# Altium project Fall22 Universal PCB Rev.1.PrjPcb (part 1 of 2)
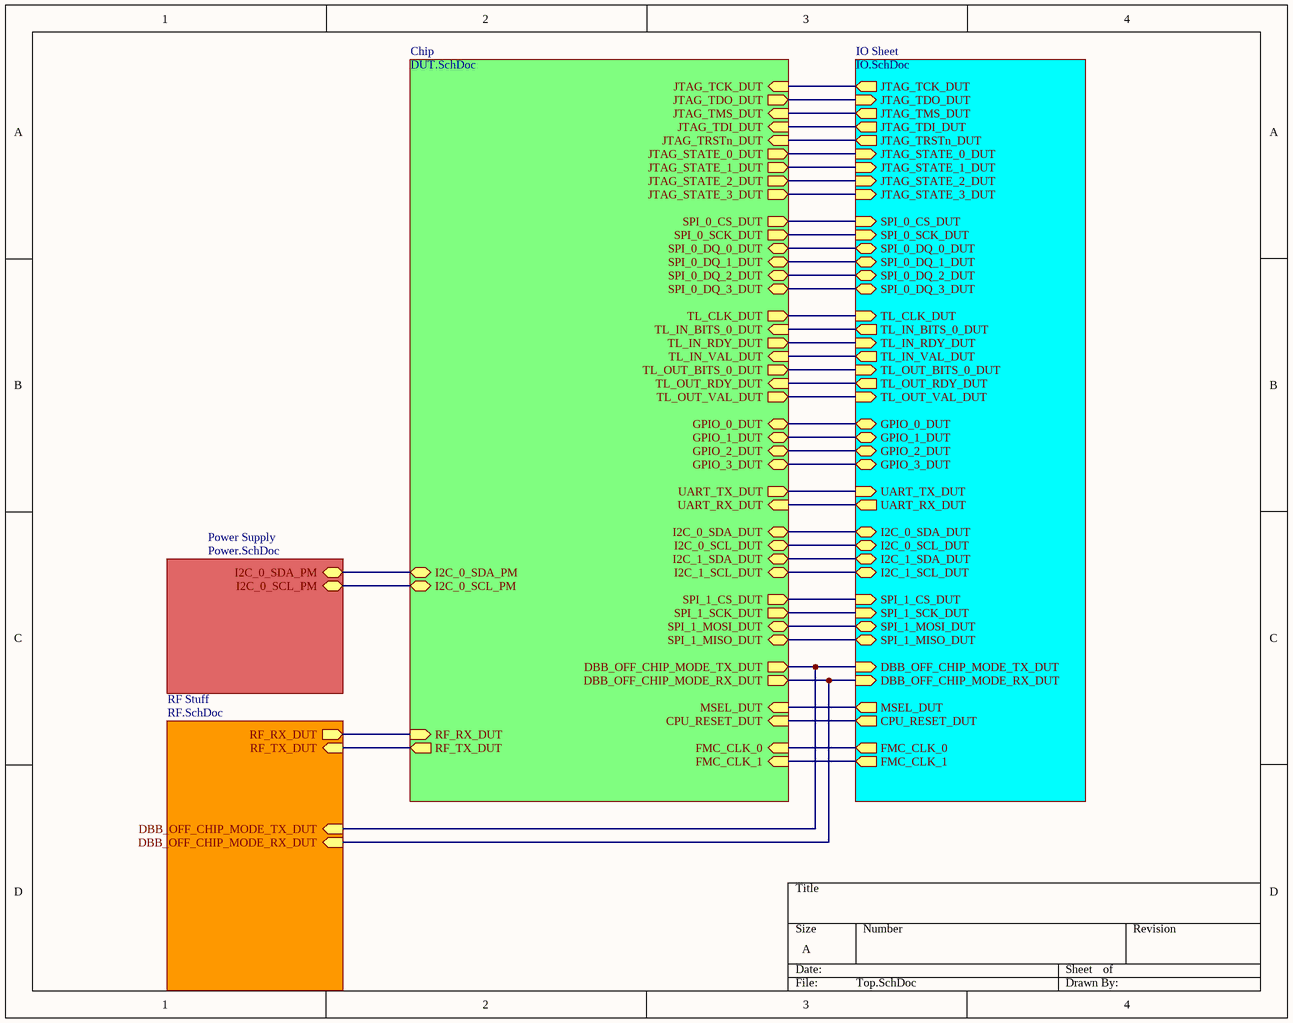
[diagram p0: Top.SchDoc]
5 sheets, 263 parts. Net scope: hierarchical (ports join the sheet entries above them; power ports are global).
Board file: PCB2.PcbDoc
Sheets:
  Top.SchDoc
    Chip = DUT.SchDoc
    Power Supply = Power.SchDoc
    IO Sheet = IO.SchDoc
    RF Stuff = RF.SchDoc

## Sheet Top.SchDoc
size A

### Sub-sheets
Chip = DUT.SchDoc: JTAG_TCK_DUT (in), JTAG_TDO_DUT (out), JTAG_TMS_DUT (in), JTAG_TDI_DUT (in), JTAG_TRSTn_DUT (in), JTAG_STATE_0_DUT (out), JTAG_STATE_1_DUT (out), JTAG_STATE_2_DUT (out), JTAG_STATE_3_DUT (out), TL_CLK_DUT (out), SPI_0_CS_DUT (out), SPI_0_SCK_DUT (out), SPI_0_DQ_0_DUT (bidir), SPI_0_DQ_1_DUT (bidir), SPI_0_DQ_2_DUT (bidir), SPI_0_DQ_3_DUT (bidir), TL_IN_BITS_0_DUT (in), TL_IN_RDY_DUT (out), TL_IN_VAL_DUT (in), TL_OUT_BITS_0_DUT (out), TL_OUT_RDY_DUT (in), TL_OUT_VAL_DUT (out), GPIO_1_DUT (bidir), GPIO_0_DUT (bidir), GPIO_2_DUT (bidir), GPIO_3_DUT (bidir), UART_TX_DUT (out), UART_RX_DUT (in), I2C_0_SDA_DUT (bidir), I2C_0_SCL_DUT (bidir), I2C_1_SDA_DUT (bidir), I2C_1_SCL_DUT (bidir), SPI_1_CS_DUT (out), SPI_1_SCK_DUT (out), SPI_1_MOSI_DUT (bidir), SPI_1_MISO_DUT (bidir), DBB_OFF_CHIP_MODE_RX_DUT (out), DBB_OFF_CHIP_MODE_TX_DUT (out), RF_RX_DUT (in), RF_TX_DUT (out), I2C_0_SDA_PM (bidir), I2C_0_SCL_PM (bidir), MSEL_DUT (in), CPU_RESET_DUT (in), FMC_CLK_0 (in), FMC_CLK_1 (in)
IO Sheet = IO.SchDoc: JTAG_TCK_DUT (out), JTAG_TDO_DUT (in), JTAG_TMS_DUT (out), JTAG_TDI_DUT (out), JTAG_TRSTn_DUT (out), JTAG_STATE_0_DUT (in), JTAG_STATE_1_DUT (in), JTAG_STATE_2_DUT (in), JTAG_STATE_3_DUT (in), SPI_0_CS_DUT (in), SPI_0_SCK_DUT (in), SPI_0_DQ_0_DUT (bidir), SPI_0_DQ_1_DUT (bidir), SPI_0_DQ_2_DUT (bidir), SPI_0_DQ_3_DUT (bidir), TL_CLK_DUT (in), TL_IN_BITS_0_DUT (out), TL_IN_RDY_DUT (in), TL_IN_VAL_DUT (out), TL_OUT_BITS_0_DUT (in), TL_OUT_RDY_DUT (out), TL_OUT_VAL_DUT (in), GPIO_1_DUT (bidir), GPIO_0_DUT (bidir), GPIO_2_DUT (bidir), GPIO_3_DUT (bidir), UART_TX_DUT (in), UART_RX_DUT (out), I2C_0_SDA_DUT (bidir), I2C_0_SCL_DUT (bidir), I2C_1_SDA_DUT (bidir), I2C_1_SCL_DUT (bidir), SPI_1_CS_DUT (in), SPI_1_SCK_DUT (in), SPI_1_MOSI_DUT (bidir), SPI_1_MISO_DUT (bidir), DBB_OFF_CHIP_MODE_RX_DUT (in), DBB_OFF_CHIP_MODE_TX_DUT (in), MSEL_DUT (out), CPU_RESET_DUT (out), FMC_CLK_0 (out), FMC_CLK_1 (out)
Power Supply = Power.SchDoc: I2C_0_SDA_PM (bidir), I2C_0_SCL_PM (bidir)
RF Stuff = RF.SchDoc: RF_RX_DUT (out), RF_TX_DUT (in), DBB_OFF_CHIP_MODE_TX_DUT (in), DBB_OFF_CHIP_MODE_RX_DUT (in)

### Nets
baseband_offChipMode_rx: sheet Chip/DBB_OFF_CHIP_MODE_RX_DUT, sheet IO Sheet/DBB_OFF_CHIP_MODE_RX_DUT, sheet RF Stuff/DBB_OFF_CHIP_MODE_RX_DUT
baseband_offChipMode_tx: sheet Chip/DBB_OFF_CHIP_MODE_TX_DUT, sheet IO Sheet/DBB_OFF_CHIP_MODE_TX_DUT, sheet RF Stuff/DBB_OFF_CHIP_MODE_TX_DUT
BOOT_SEL: sheet Chip/MSEL_DUT, sheet IO Sheet/MSEL_DUT
CPU_RESET_DUT: sheet Chip/CPU_RESET_DUT, sheet IO Sheet/CPU_RESET_DUT
GPIO_0_DUT: sheet Chip/GPIO_0_DUT, sheet IO Sheet/GPIO_0_DUT
GPIO_1_DUT: sheet Chip/GPIO_1_DUT, sheet IO Sheet/GPIO_1_DUT
GPIO_2_DUT: sheet Chip/GPIO_2_DUT, sheet IO Sheet/GPIO_2_DUT
GPIO_3_DUT: sheet Chip/GPIO_3_DUT, sheet IO Sheet/GPIO_3_DUT
I2C2_SCL: sheet Chip/I2C_0_SCL_PM, sheet Power Supply/I2C_0_SCL_PM
I2C2_SDA: sheet Chip/I2C_0_SDA_PM, sheet Power Supply/I2C_0_SDA_PM
I2C_0_SCL_DUT: sheet Chip/I2C_1_SCL_DUT, sheet IO Sheet/I2C_1_SCL_DUT
I2C_0_SDA_DUT: sheet Chip/I2C_1_SDA_DUT, sheet IO Sheet/I2C_1_SDA_DUT
I2C_1_SCL_DUT: sheet Chip/I2C_0_SCL_DUT, sheet IO Sheet/I2C_0_SCL_DUT
I2C_1_SDA_DUT: sheet Chip/I2C_0_SDA_DUT, sheet IO Sheet/I2C_0_SDA_DUT
JTAG_STATE_0_DUT: sheet Chip/JTAG_STATE_0_DUT, sheet IO Sheet/JTAG_STATE_0_DUT
JTAG_STATE_1_DUT: sheet Chip/JTAG_STATE_1_DUT, sheet IO Sheet/JTAG_STATE_1_DUT
JTAG_STATE_2_DUT: sheet Chip/JTAG_STATE_2_DUT, sheet IO Sheet/JTAG_STATE_2_DUT
JTAG_STATE_3_DUT: sheet Chip/JTAG_STATE_3_DUT, sheet IO Sheet/JTAG_STATE_3_DUT
JTAG_TCK: sheet Chip/JTAG_TCK_DUT, sheet IO Sheet/JTAG_TCK_DUT
JTAG_TDI: sheet Chip/JTAG_TDI_DUT, sheet IO Sheet/JTAG_TDI_DUT
JTAG_TDO: sheet Chip/JTAG_TDO_DUT, sheet IO Sheet/JTAG_TDO_DUT
JTAG_TMS: sheet Chip/JTAG_TMS_DUT, sheet IO Sheet/JTAG_TMS_DUT
JTAG_TRST: sheet Chip/JTAG_TRSTn_DUT, sheet IO Sheet/JTAG_TRSTn_DUT
RF_RX_DUT: sheet Chip/RF_RX_DUT, sheet RF Stuff/RF_RX_DUT
RF_TX_DUT: sheet Chip/RF_TX_DUT, sheet RF Stuff/RF_TX_DUT
SCAN_CLK: sheet Chip/SPI_1_SCK_DUT, sheet IO Sheet/SPI_1_SCK_DUT
SCAN_IN: sheet Chip/SPI_1_MISO_DUT, sheet IO Sheet/SPI_1_MISO_DUT
SCAN_OUT: sheet Chip/SPI_1_MOSI_DUT, sheet IO Sheet/SPI_1_MOSI_DUT
SCAN_SEL: sheet Chip/SPI_1_CS_DUT, sheet IO Sheet/SPI_1_CS_DUT
SPI0_CS: sheet Chip/SPI_0_CS_DUT, sheet IO Sheet/SPI_0_CS_DUT
SPI0_DQ0: sheet Chip/SPI_0_DQ_0_DUT, sheet IO Sheet/SPI_0_DQ_0_DUT
SPI0_DQ1: sheet Chip/SPI_0_DQ_1_DUT, sheet IO Sheet/SPI_0_DQ_1_DUT
SPI0_DQ2: sheet Chip/SPI_0_DQ_2_DUT, sheet IO Sheet/SPI_0_DQ_2_DUT
SPI0_DQ3: sheet Chip/SPI_0_DQ_3_DUT, sheet IO Sheet/SPI_0_DQ_3_DUT
SPI0_SCLK: sheet Chip/SPI_0_SCK_DUT, sheet IO Sheet/SPI_0_SCK_DUT
TL_CLK: sheet Chip/TL_CLK_DUT, sheet IO Sheet/TL_CLK_DUT
TL_IN_BITS_0_DUT: sheet Chip/TL_IN_BITS_0_DUT, sheet IO Sheet/TL_IN_BITS_0_DUT
TL_IN_RDY: sheet Chip/TL_IN_RDY_DUT, sheet IO Sheet/TL_IN_RDY_DUT
TL_IN_VAL: sheet Chip/TL_IN_VAL_DUT, sheet IO Sheet/TL_IN_VAL_DUT
TL_OUT_BITS_0_DUT: sheet Chip/TL_OUT_BITS_0_DUT, sheet IO Sheet/TL_OUT_BITS_0_DUT
TL_OUT_RDY: sheet Chip/TL_OUT_RDY_DUT, sheet IO Sheet/TL_OUT_RDY_DUT
TL_OUT_VAL: sheet Chip/TL_OUT_VAL_DUT, sheet IO Sheet/TL_OUT_VAL_DUT
UART0_RX: sheet Chip/UART_RX_DUT, sheet IO Sheet/UART_RX_DUT
UART0_TX: sheet Chip/UART_TX_DUT, sheet IO Sheet/UART_TX_DUT
NetH1_1: sheet Chip/FMC_CLK_0, sheet IO Sheet/FMC_CLK_0
NetH2_1: sheet Chip/FMC_CLK_1, sheet IO Sheet/FMC_CLK_1

## Sheet DUT.SchDoc
size A1; SPICEModelCacheEPBFKGZM: <root> / <DocumentId>EPBFKGZM</DocumentId> / </root>
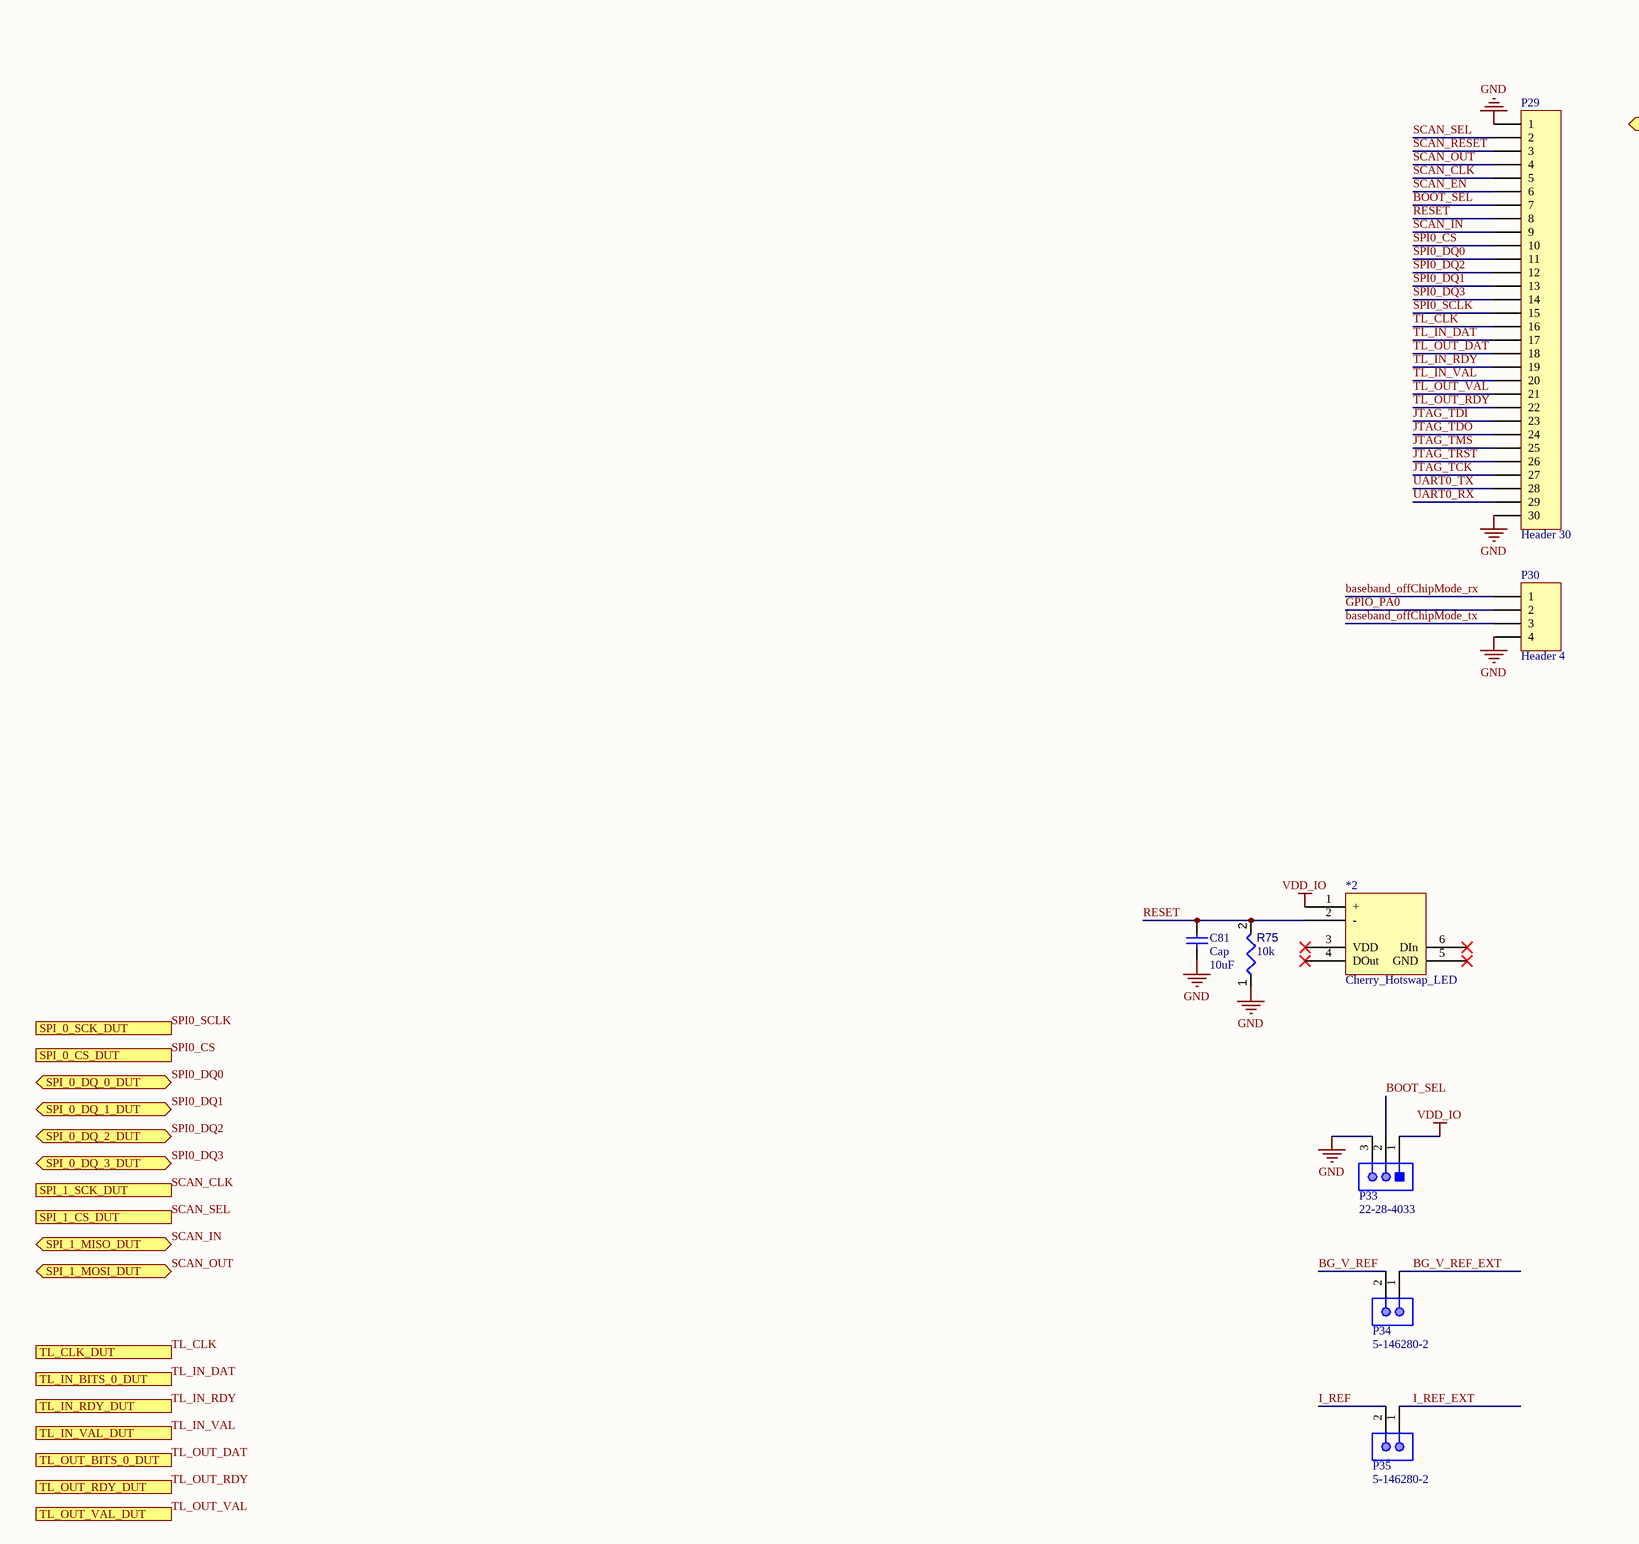
[diagram p1: DUT.SchDoc, top left]
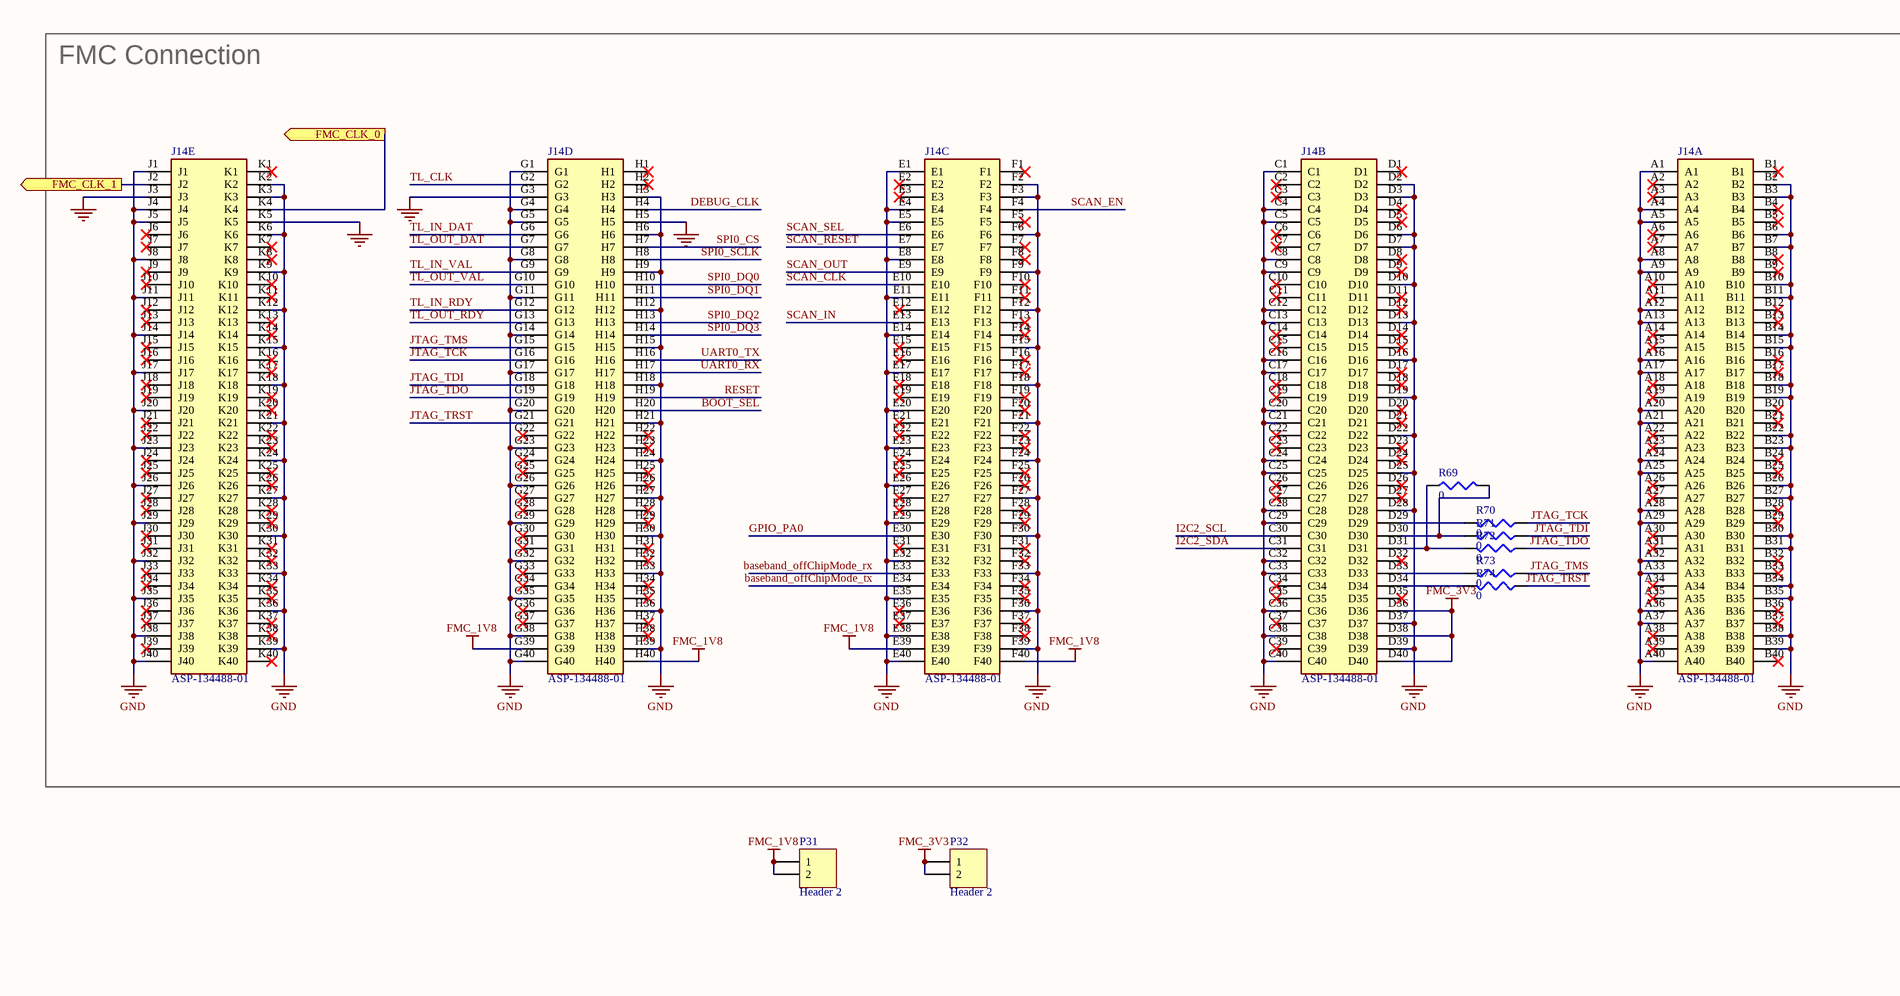
[diagram p2: DUT.SchDoc, top right]
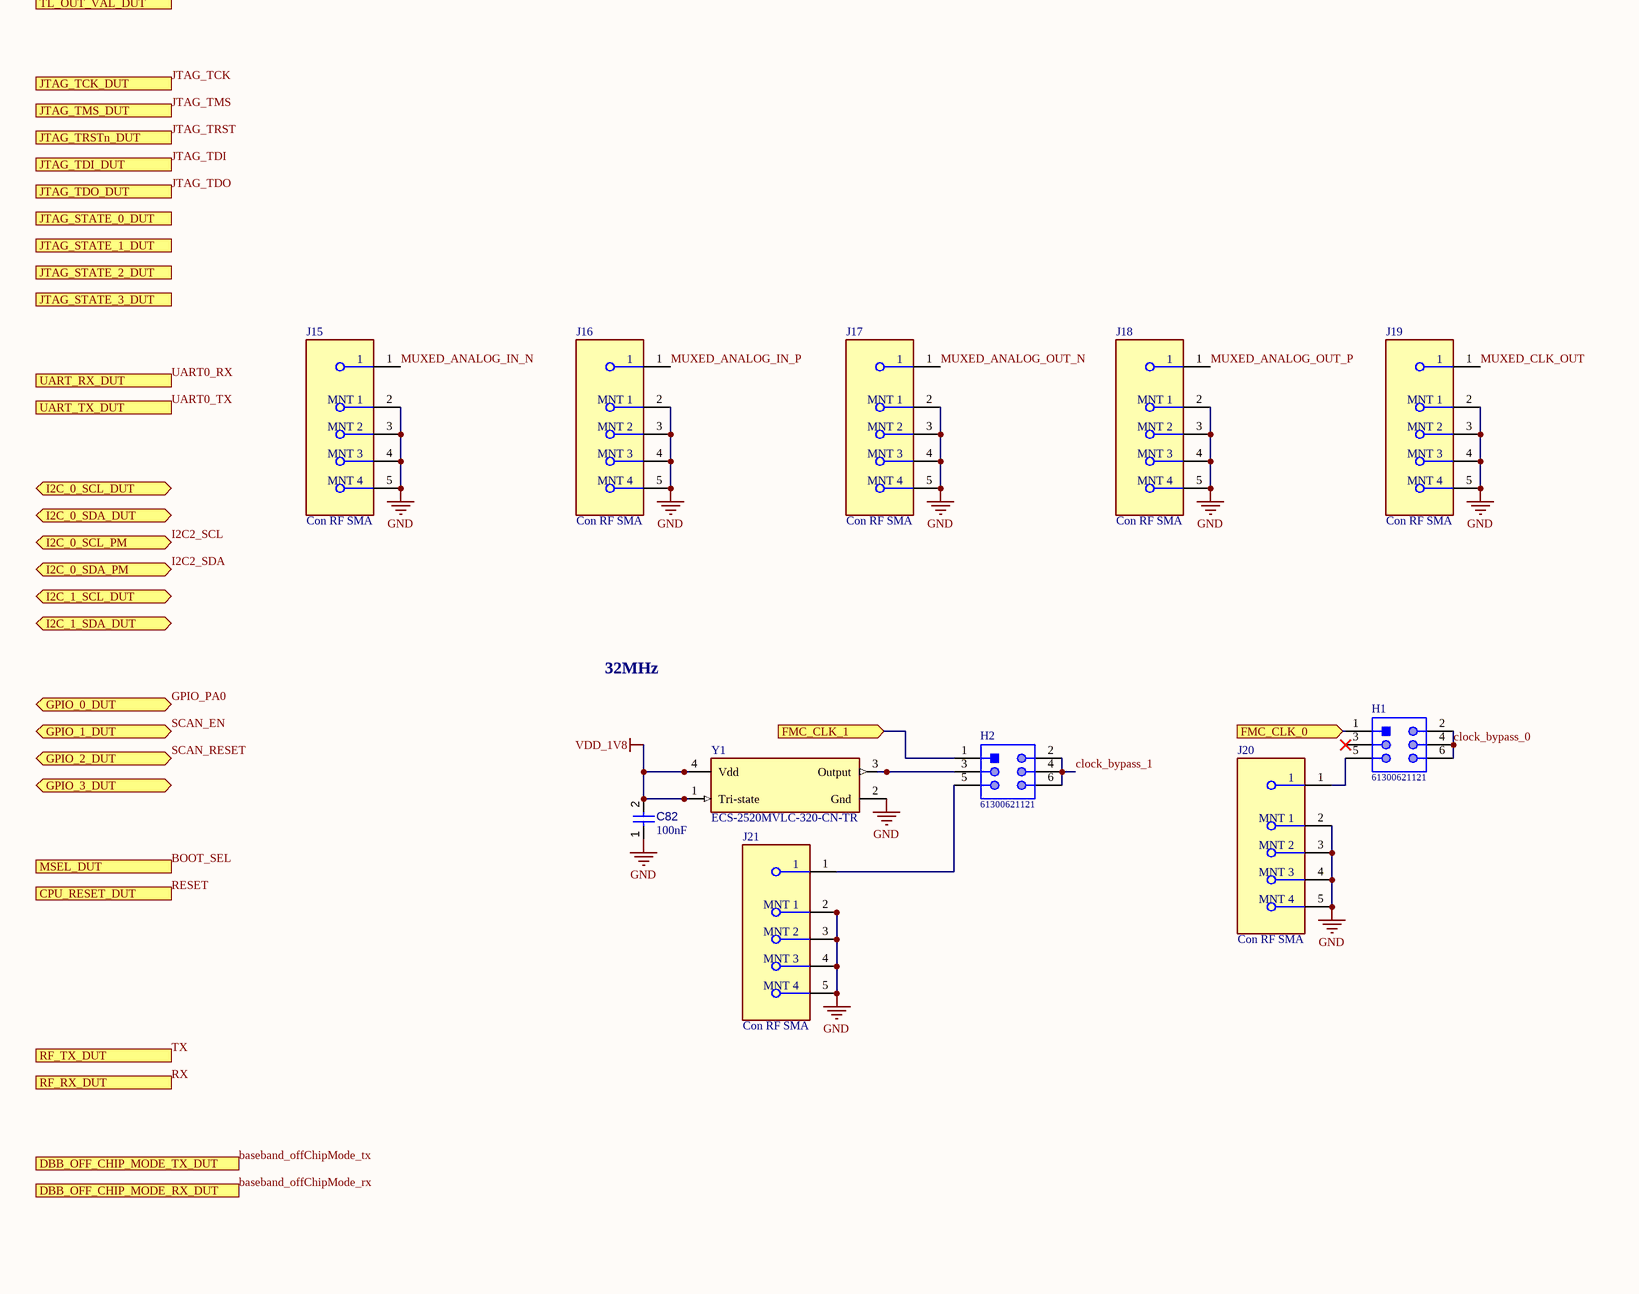
[diagram p3: DUT.SchDoc, bottom left]
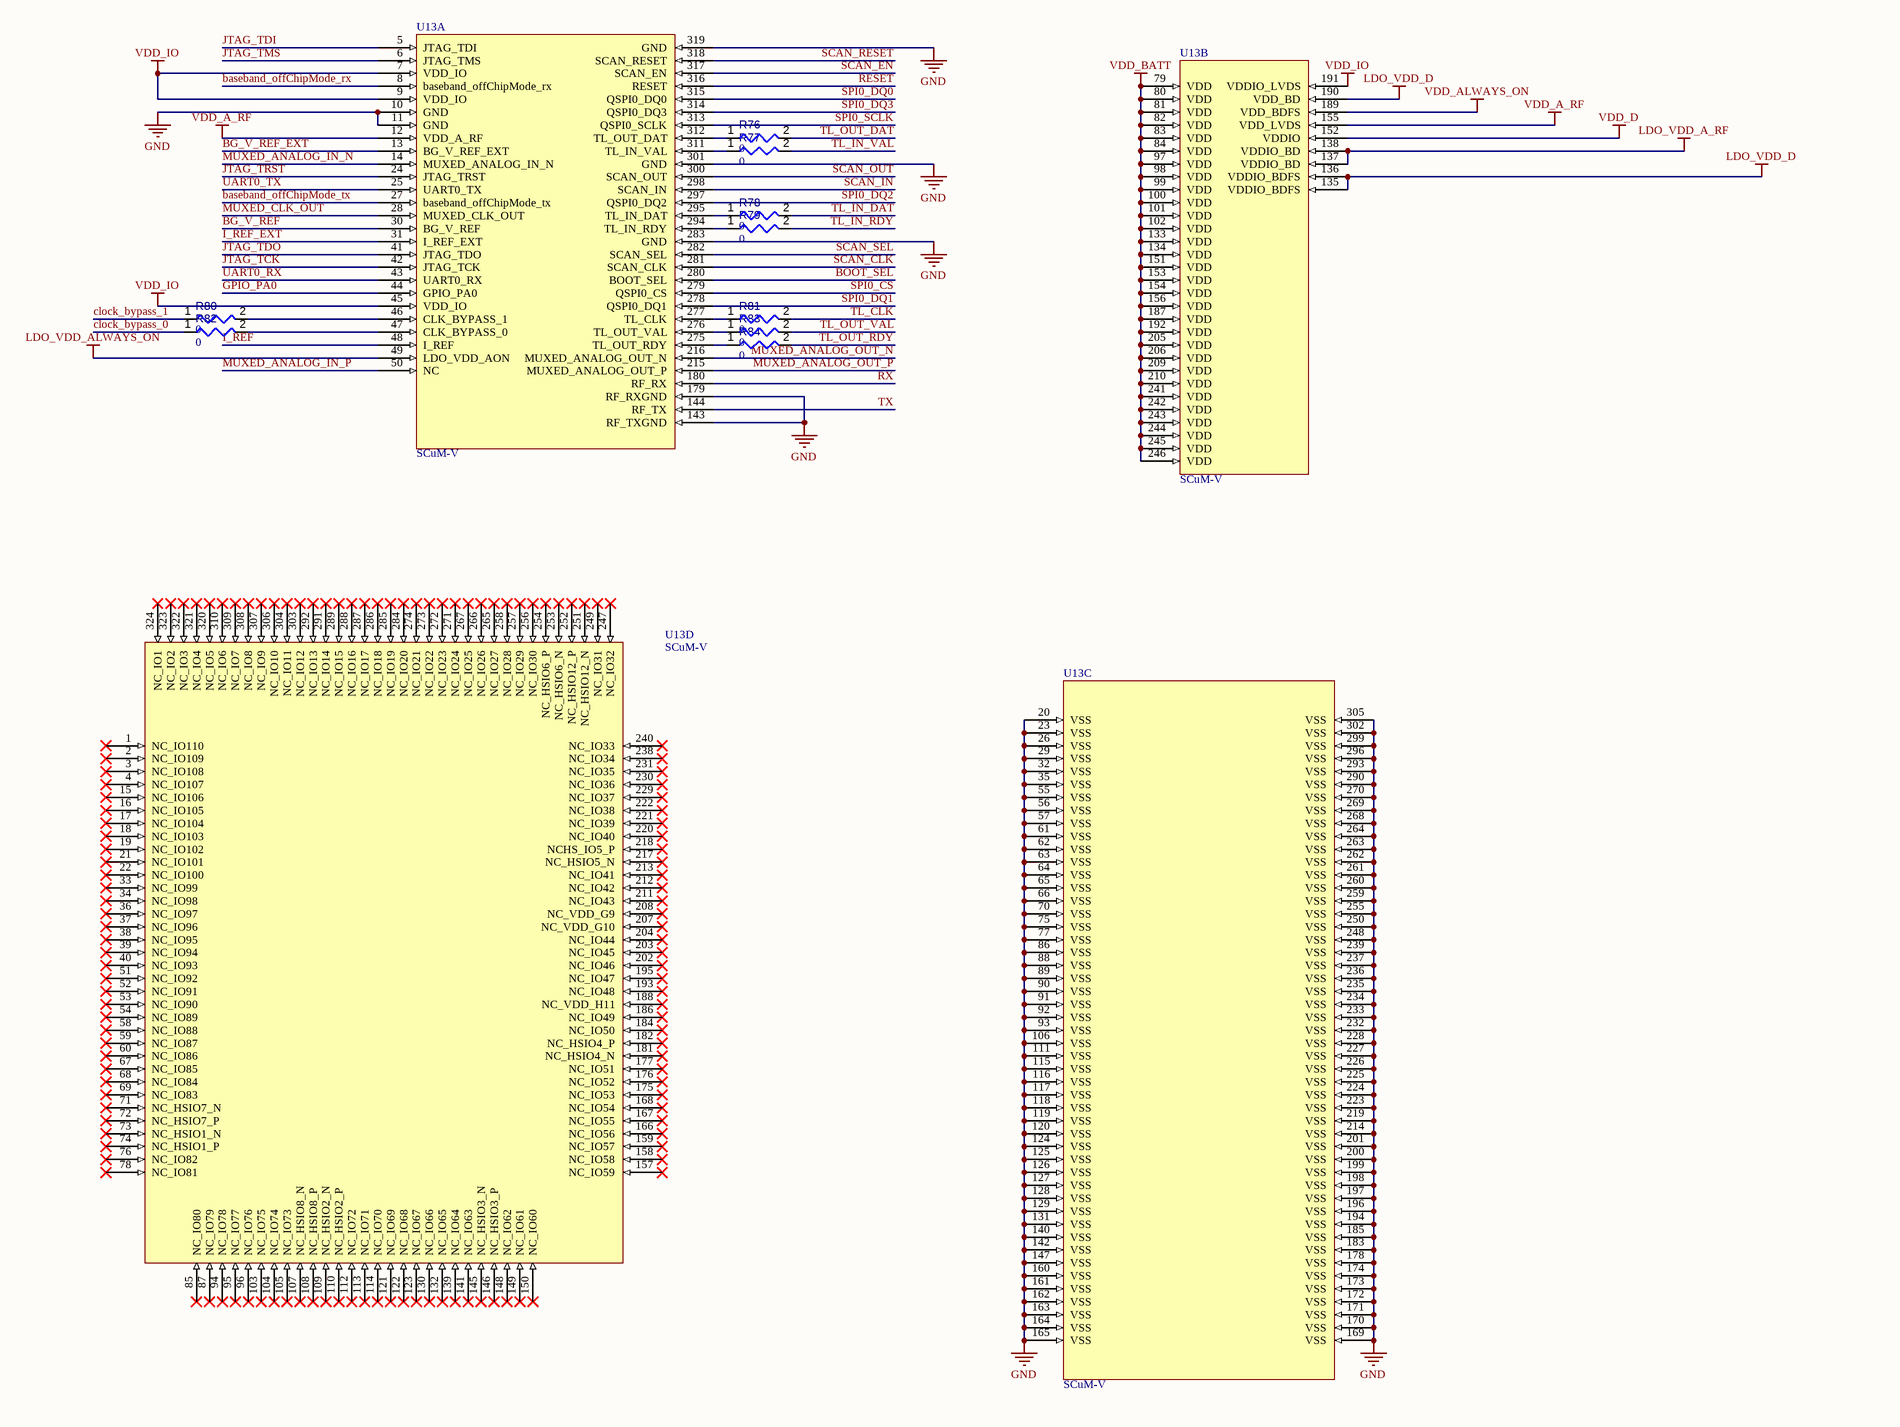
[diagram p4: DUT.SchDoc, bottom right]

### Parts
*2  Cherry_Hotswap_LED  [New footprint 1]
C81  Cap  value 10uF  [0805]
C82  value 100nF  [CAPC1608X90X40NL10T20]  (hidden comment: Capacitor 100 nF +/-10% 50 V 0603)
H1  61300621121  [61300621121]
H2  61300621121  [61300621121]
J14  ASP-134488-01  [SAMTEC_ASP-134488-01]  (parts A,B,C,D,E of 5)
J15  Con RF SMA  [FP-RF2-04A-T-00-50-G-MFG]
J16  Con RF SMA  [FP-RF2-04A-T-00-50-G-MFG]
J17  Con RF SMA  [FP-RF2-04A-T-00-50-G-MFG]
J18  Con RF SMA  [FP-RF2-04A-T-00-50-G-MFG]
J19  Con RF SMA  [FP-RF2-04A-T-00-50-G-MFG]
J20  Con RF SMA  [FP-RF2-04A-T-00-50-G-MFG]
J21  Con RF SMA  [FP-RF2-04A-T-00-50-G-MFG]
P29  Header 30  [HDR1X30]
P30  Header 4  [HDR1X4]
P31  Header 2  [HDR1X2]
P32  Header 2  [HDR1X2]
P33  22-28-4033  [MOLX-22-28-4033_V]
P34  5-146280-2  [TECO-5-146280-2_V]
P35  5-146280-2  [TECO-5-146280-2_V]
R69  0  [0603]
R70  0  [0603]
R71  0  [0603]
R72  0  [0603]
R73  0  [0603]
R74  0  [0603]
R75  value 10k  [RESC1608X55X25ML10T15]  (hidden comment: Resistor 10k +/-1% 0603 100 mW)
R76  value 0  [RESC0402(1005)_L]  (hidden comment: 0R2J)
R77  value 0  [RESC0402(1005)_L]  (hidden comment: 0R2J)
R78  value 0  [RESC0402(1005)_L]  (hidden comment: 0R2J)
R79  value 0  [RESC0402(1005)_L]  (hidden comment: 0R2J)
R80  value 0  [RESC0402(1005)_L]  (hidden comment: 0R2J)
R81  value 0  [RESC0402(1005)_L]  (hidden comment: 0R2J)
R82  value 0  [RESC0402(1005)_L]  (hidden comment: 0R2J)
R83  value 0  [RESC0402(1005)_L]  (hidden comment: 0R2J)
R84  value 0  [RESC0402(1005)_L]  (hidden comment: 0R2J)
U13  SCuM-V  [BGA324x18]  (parts A,B,C,D of 4)
Y1  ECS-2520MVLC-320-CN-TR  [FP-ECS-2520MVLC-MFG]

### Blocks framed on the sheet
FMC Connection: J14 R69-R74

### Ports
CPU_RESET_DUT (in), DBB_OFF_CHIP_MODE_RX_DUT (out), DBB_OFF_CHIP_MODE_TX_DUT (out), FMC_CLK_0 (in), FMC_CLK_0 (out), FMC_CLK_1 (in), FMC_CLK_1 (out), GPIO_0_DUT (bidir), GPIO_1_DUT (bidir), GPIO_2_DUT (bidir), GPIO_3_DUT (bidir), I2C_0_SCL_DUT (bidir), I2C_0_SCL_PM (bidir), I2C_0_SDA_DUT (bidir), I2C_0_SDA_PM (bidir), I2C_1_SCL_DUT (bidir), I2C_1_SDA_DUT (bidir), JTAG_STATE_0_DUT (out), JTAG_STATE_1_DUT (out), JTAG_STATE_2_DUT (out), JTAG_STATE_3_DUT (out), JTAG_TCK_DUT (in), JTAG_TDI_DUT (in), JTAG_TDO_DUT (out), JTAG_TMS_DUT (in), JTAG_TRSTn_DUT (in), MSEL_DUT (out), RF_RX_DUT (in), RF_TX_DUT (out), SPI_0_CS_DUT (out), SPI_0_DQ_0_DUT (bidir), SPI_0_DQ_1_DUT (bidir), SPI_0_DQ_2_DUT (bidir), SPI_0_DQ_3_DUT (bidir), SPI_0_SCK_DUT (out), SPI_1_CS_DUT (out), SPI_1_MISO_DUT (bidir), SPI_1_MOSI_DUT (bidir), SPI_1_SCK_DUT (out), TL_CLK_DUT (out), TL_IN_BITS_0_DUT (in), TL_IN_RDY_DUT (out), TL_IN_VAL_DUT (in), TL_OUT_BITS_0_DUT (out), TL_OUT_RDY_DUT (in), TL_OUT_VAL_DUT (out), UART_RX_DUT (in), UART_TX_DUT (out)

### Nets
FMC_1V8: J14.E39 J14.F40 J14.G39 J14.H40 P31.1 P31.2
FMC_3V3: J14.D36 J14.D38 J14.D40 P32.1 P32.2
GND: C81.1 C82.1 J14.A1 J14.A4 J14.A5 J14.A8 J14.A9 J14.A12 J14.A13 J14.A16 J14.A17 J14.A20 J14.A21 J14.A24 J14.A25 J14.A28 J14.A29 J14.A32 J14.A33 J14.A36 J14.A37 J14.A40 J14.B2 J14.B3 J14.B6 J14.B7 J14.B10 J14.B11 J14.B14 J14.B15 J14.B18 J14.B19 J14.B22 J14.B23 J14.B26 J14.B27 J14.B30 J14.B31 J14.B34 J14.B35 J14.B38 J14.B39 J14.C1 J14.C4 J14.C5 J14.C8 J14.C9 J14.C12 J14.C13 J14.C16 J14.C17 J14.C20 J14.C21 J14.C24 J14.C25 J14.C28 J14.C29 J14.C32 J14.C33 J14.C36 J14.C38 J14.C40 J14.D2 J14.D3 J14.D6 J14.D7 J14.D10 J14.D13 J14.D16 J14.D19 J14.D22 J14.D25 J14.D28 J14.D37 J14.D39 J14.E1 J14.E4 J14.E5 J14.E8 J14.E11 J14.E14 J14.E17 J14.E20 J14.E23 J14.E26 J14.E29 J14.E32 J14.E35 J14.E38 J14.E40 J14.F2 J14.F3 J14.F6 J14.F9 J14.F12 J14.F15 J14.F18 J14.F21 J14.F24 J14.F27 J14.F30 J14.F33 J14.F36 J14.F39 J14.G1 J14.G3 J14.G4 J14.G5 J14.G8 J14.G11 J14.G14 J14.G17 J14.G20 J14.G23 J14.G26 J14.G29 J14.G32 J14.G35 J14.G38 J14.G40 J14.H3 J14.H5 J14.H6 J14.H9 J14.H12 J14.H15 J14.H18 J14.H21 J14.H24 J14.H27 J14.H30 J14.H33 J14.H36 J14.H39 J14.J1 J14.J3 J14.J4 J14.J5 J14.J8 J14.J11 J14.J14 J14.J17 J14.J20 J14.J23 J14.J26 J14.J29 J14.J32 J14.J35 J14.J38 J14.J40 J14.K2 J14.K3 J14.K5 J14.K6 J14.K9 J14.K12 J14.K15 J14.K18 J14.K21 J14.K24 J14.K27 J14.K30 J14.K33 J14.K36 J14.K39 J15.2(MNT_1) J15.3(MNT_2) J15.4(MNT_3) J15.5(MNT_4) J16.2(MNT_1) J16.3(MNT_2) J16.4(MNT_3) J16.5(MNT_4) J17.2(MNT_1) J17.3(MNT_2) J17.4(MNT_3) J17.5(MNT_4) J18.2(MNT_1) J18.3(MNT_2) J18.4(MNT_3) J18.5(MNT_4) J19.2(MNT_1) J19.3(MNT_2) J19.4(MNT_3) J19.5(MNT_4) J20.2(MNT_1) J20.3(MNT_2) J20.4(MNT_3) J20.5(MNT_4) J21.2(MNT_1) J21.3(MNT_2) J21.4(MNT_3) J21.5(MNT_4) P29.1 P29.30 P30.4 P33.3 R75.1 U13.10(GND) U13.11(GND) U13.20(VSS) U13.23(VSS) U13.26(VSS) U13.29(VSS) U13.32(VSS) U13.35(VSS) U13.55(VSS) U13.56(VSS) U13.57(VSS) U13.61(VSS) U13.62(VSS) U13.63(VSS) U13.64(VSS) U13.65(VSS) U13.66(VSS) U13.70(VSS) U13.75(VSS) U13.77(VSS) U13.86(VSS) U13.88(VSS) U13.89(VSS) U13.90(VSS) U13.91(VSS) U13.92(VSS) U13.93(VSS) U13.106(VSS) U13.111(VSS) U13.115(VSS) U13.116(VSS) U13.117(VSS) U13.118(VSS) U13.119(VSS) U13.120(VSS) U13.124(VSS) U13.125(VSS) U13.126(VSS) U13.127(VSS) U13.128(VSS) U13.129(VSS) U13.131(VSS) U13.140(VSS) U13.142(VSS) U13.143(RF_TXGND) U13.147(VSS) U13.160(VSS) U13.161(VSS) U13.162(VSS) U13.163(VSS) U13.164(VSS) U13.165(VSS) U13.169(VSS) U13.170(VSS) U13.171(VSS) U13.172(VSS) U13.173(VSS) U13.174(VSS) U13.178(VSS) U13.179(RF_RXGND) U13.183(VSS) U13.185(VSS) U13.194(VSS) U13.196(VSS) U13.197(VSS) U13.198(VSS) U13.199(VSS) U13.200(VSS) U13.201(VSS) U13.214(VSS) U13.219(VSS) U13.223(VSS) U13.224(VSS) U13.225(VSS) U13.226(VSS) U13.227(VSS) U13.228(VSS) U13.232(VSS) U13.233(VSS) U13.234(VSS) U13.235(VSS) U13.236(VSS) U13.237(VSS) U13.239(VSS) U13.248(VSS) U13.250(VSS) U13.255(VSS) U13.259(VSS) U13.260(VSS) U13.261(VSS) U13.262(VSS) U13.263(VSS) U13.264(VSS) U13.268(VSS) U13.269(VSS) U13.270(VSS) U13.283(GND) U13.290(VSS) U13.293(VSS) U13.296(VSS) U13.299(VSS) U13.301(GND) U13.302(VSS) U13.305(VSS) U13.319(GND) Y1.2(Gnd)
LDO_VDD_A_RF: U13.137(VDDIO_BD) U13.138(VDDIO_BD)
LDO_VDD_ALWAYS_ON: U13.49(LDO_VDD_AON)
LDO_VDD_D: U13.135(VDDIO_BDFS) U13.136(VDDIO_BDFS) U13.190(VDD_BD)
VDD_1V8: C82.2 Y1.1(Tri-state) Y1.4(Vdd)
VDD_A_RF: U13.12(VDD_A_RF) U13.155(VDD_LVDS)
VDD_ALWAYS_ON: U13.189(VDD_BDFS)
VDD_BATT: U13.79(VDD) U13.80(VDD) U13.81(VDD) U13.82(VDD) U13.83(VDD) U13.84(VDD) U13.97(VDD) U13.98(VDD) U13.99(VDD) U13.100(VDD) U13.101(VDD) U13.102(VDD) U13.133(VDD) U13.134(VDD) U13.151(VDD) U13.153(VDD) U13.154(VDD) U13.156(VDD) U13.187(VDD) U13.192(VDD) U13.205(VDD) U13.206(VDD) U13.209(VDD) U13.210(VDD) U13.241(VDD) U13.242(VDD) U13.243(VDD) U13.244(VDD) U13.245(VDD) U13.246(VDD)
VDD_D: U13.152(VDDIO)
VDD_IO: *2.1(+) P33.1 U13.7(VDD_IO) U13.9(VDD_IO) U13.45(VDD_IO) U13.191(VDDIO_LVDS)  [project net 1V8_DUT]
baseband_offChipMode_rx: J14.E33 P30.1 U13.8(baseband_offChipMode_rx) ; port DBB_OFF_CHIP_MODE_RX_DUT
baseband_offChipMode_tx: J14.E34 P30.3 U13.27(baseband_offChipMode_tx) ; port DBB_OFF_CHIP_MODE_TX_DUT
BG_V_REF: P34.2 U13.30(BG_V_REF)
BG_V_REF_EXT: P34.1 U13.13(BG_V_REF_EXT)
BOOT_SEL: J14.H20 P29.7 P33.2 U13.280(BOOT_SEL) ; port MSEL_DUT
clock_bypass_0: H1.2 H1.4 H1.6 R82.1
clock_bypass_1: H2.2 H2.4 H2.6 R80.1
DEBUG_CLK: J14.H4
GPIO_PA0: J14.E30 P30.2 U13.44(GPIO_PA0) ; port GPIO_0_DUT  [project net GPIO_0_DUT]
I2C2_SCL: J14.C30 ; port I2C_0_SCL_PM
I2C2_SDA: J14.C31 ; port I2C_0_SDA_PM
I_REF: P35.2 U13.48(I_REF)
I_REF_EXT: P35.1 U13.31(I_REF_EXT)
JTAG_TCK: J14.G16 P29.27 R70.2 U13.42(JTAG_TCK) ; port JTAG_TCK_DUT
JTAG_TDI: J14.G18 P29.23 R71.2 U13.5(JTAG_TDI) ; port JTAG_TDI_DUT
JTAG_TDO: J14.G19 P29.24 R72.2 U13.41(JTAG_TDO) ; port JTAG_TDO_DUT
JTAG_TMS: J14.G15 P29.25 R73.2 U13.6(JTAG_TMS) ; port JTAG_TMS_DUT
JTAG_TRST: J14.G21 P29.26 R74.2 U13.24(JTAG_TRST) ; port JTAG_TRSTn_DUT
MUXED_ANALOG_IN_N: J15.1 U13.14(MUXED_ANALOG_IN_N)
MUXED_ANALOG_IN_P: J16.1 U13.50(NC)
MUXED_ANALOG_OUT_N: J17.1 U13.216(MUXED_ANALOG_OUT_N)
MUXED_ANALOG_OUT_P: J18.1 U13.215(MUXED_ANALOG_OUT_P)
MUXED_CLK_OUT: J19.1 U13.28(MUXED_CLK_OUT)
RESET: *2.2(-) C81.2 J14.H19 P29.8 R75.2 U13.316(RESET) ; port CPU_RESET_DUT  [project net CPU_RESET_DUT]
RX: U13.180(RF_RX) ; port RF_RX_DUT  [project net RF_RX_DUT]
SCAN_CLK: J14.E10 P29.5 U13.281(SCAN_CLK) ; port SPI_1_SCK_DUT
SCAN_EN: J14.F4 P29.6 U13.317(SCAN_EN) ; port GPIO_1_DUT  [project net GPIO_1_DUT]
SCAN_IN: J14.E13 P29.9 U13.298(SCAN_IN) ; port SPI_1_MISO_DUT
SCAN_OUT: J14.E9 P29.4 U13.300(SCAN_OUT) ; port SPI_1_MOSI_DUT
SCAN_RESET: J14.E7 P29.3 U13.318(SCAN_RESET) ; port GPIO_2_DUT  [project net GPIO_2_DUT]
SCAN_SEL: J14.E6 P29.2 U13.282(SCAN_SEL) ; port SPI_1_CS_DUT
SPI0_CS: J14.H7 P29.10 U13.279(QSPI0_CS) ; port SPI_0_CS_DUT
SPI0_DQ0: J14.H10 P29.11 U13.315(QSPI0_DQ0) ; port SPI_0_DQ_0_DUT
SPI0_DQ1: J14.H11 P29.13 U13.278(QSPI0_DQ1) ; port SPI_0_DQ_1_DUT
SPI0_DQ2: J14.H13 P29.12 U13.297(QSPI0_DQ2) ; port SPI_0_DQ_2_DUT
SPI0_DQ3: J14.H14 P29.14 U13.314(QSPI0_DQ3) ; port SPI_0_DQ_3_DUT
SPI0_SCLK: J14.H8 P29.15 U13.313(QSPI0_SCLK) ; port SPI_0_SCK_DUT
TL_CLK: J14.G2 P29.16 R81.2 ; port TL_CLK_DUT
TL_IN_DAT: J14.G6 P29.17 R78.2 ; port TL_IN_BITS_0_DUT  [project net TL_IN_BITS_0_DUT]
TL_IN_RDY: J14.G12 P29.19 R79.2 ; port TL_IN_RDY_DUT
TL_IN_VAL: J14.G9 P29.20 R77.2 ; port TL_IN_VAL_DUT
TL_OUT_DAT: J14.G7 P29.18 R76.2 ; port TL_OUT_BITS_0_DUT  [project net TL_OUT_BITS_0_DUT]
TL_OUT_RDY: J14.G13 P29.22 R84.2 ; port TL_OUT_RDY_DUT
TL_OUT_VAL: J14.G10 P29.21 R83.2 ; port TL_OUT_VAL_DUT
TX: U13.144(RF_TX) ; port RF_TX_DUT  [project net RF_TX_DUT]
UART0_RX: J14.H17 P29.29 U13.43(UART0_RX) ; port UART_RX_DUT
UART0_TX: J14.H16 P29.28 U13.25(UART0_TX) ; port UART_TX_DUT
NetH1_1: H1.1 J14.K4 ; port FMC_CLK_0
NetH1_5: H1.5 J20.1
NetH2_1: H2.1 J14.J2 ; port FMC_CLK_1
NetH2_3: H2.3 Y1.3(Output)
NetH2_5: H2.5 J21.1
NetJ14_D29: J14.D29 R70.1
NetJ14_D30: J14.D30 R69.1 R71.1
NetJ14_D31: J14.D31 R69.2 R72.1
NetJ14_D33: J14.D33 R73.1
NetJ14_D34: J14.D34 R74.1
NetR76_1: R76.1 U13.312(TL_OUT_DAT)
NetR77_1: R77.1 U13.311(TL_IN_VAL)
NetR78_1: R78.1 U13.295(TL_IN_DAT)
NetR79_1: R79.1 U13.294(TL_IN_RDY)
NetR80_2: R80.2 U13.46(CLK_BYPASS_1)
NetR81_1: R81.1 U13.277(TL_CLK)
NetR82_2: R82.2 U13.47(CLK_BYPASS_0)
NetR83_1: R83.1 U13.276(TL_OUT_VAL)
NetR84_1: R84.1 U13.275(TL_OUT_RDY)

Not connected (* = marked no-connect by the designer): *2 3(VDD)* 4(DOut)* 5(GND)* 6(DIn)*; H1 3*; J14 A2* A3* A6* A7* A10* A11* A14* A15* A18* A19* A22* A23* A26* A27* A30* A31* A34* A35* A38* A39* B1* B4* B5* B8* B9* B12* B13* B16* B17* B20* B21* B24* B25* B28* B29* B32* B33* B36* B37* B40* C2* C3* C6* C7* C10* C11* C14* C15* C18* C19* C22* C23* C26* C27* C34* C35* C37* C39* D1* D4* D5* D8* D9* D11* D12* D14* D15* D17* D18* D20* D21* D23* D24* D26* D27* D32* D35* E2* E3* E12* E15* E16* E18* E19* E21* E22* E24* E25* E27* E28* E31* E36* E37* F1* F5* F7* F8* F10* F11* F13* F14* F16* F17* F19* F20* F22* F23* F25* F26* F28* F29* F31* F32* F34* F35* F37* F38* G22* G24* G25* G27* G28* G30* G31* G33* G34* G36* G37* H1* H2* H22* H23* H25* H26* H28* H29* H31* H32* H34* H35* H37* H38* J6* J7* J9* J10* J12* J13* J15* J16* J18* J19* J21* J22* J24* J25* J27* J28* J30* J31* J33* J34* J36* J37* J39* K1* K7* K8* K10* K11* K13* K14* K16* K17* K19* K20* K22* K23* K25* K26* K28* K29* K31* K32* K34* K35* K37* K38* K40*; U13 1(NC_IO110)* 2(NC_IO109)* 3(NC_IO108)* 4(NC_IO107)* 15(NC_IO106)* 16(NC_IO105)* 17(NC_IO104)* 18(NC_IO103)* 19(NC_IO102)* 21(NC_IO101)* 22(NC_IO100)* 33(NC_IO99)* 34(NC_IO98)* 36(NC_IO97)* 37(NC_IO96)* 38(NC_IO95)* 39(NC_IO94)* 40(NC_IO93)* 51(NC_IO92)* 52(NC_IO91)* 53(NC_IO90)* 54(NC_IO89)* 58(NC_IO88)* 59(NC_IO87)* 60(NC_IO86)* 67(NC_IO85)* 68(NC_IO84)* 69(NC_IO83)* 71(NC_HSIO7_N)* 72(NC_HSIO7_P)* 73(NC_HSIO1_N)* 74(NC_HSIO1_P)* 76(NC_IO82)* 78(NC_IO81)* 85(NC_IO80)* 87(NC_IO79)* 94(NC_IO78)* 95(NC_IO77)* 96(NC_IO76)* 103(NC_IO75)* 104(NC_IO74)* 105(NC_IO73)* 107(NC_HSIO8_N)* 108(NC_HSIO8_P)* 109(NC_HSIO2_N)* 110(NC_HSIO2_P)* 112(NC_IO72)* 113(NC_IO71)* 114(NC_IO70)* 121(NC_IO69)* 122(NC_IO68)* 123(NC_IO67)* 130(NC_IO66)* 132(NC_IO65)* 139(NC_IO64)* 141(NC_IO63)* 145(NC_HSIO3_N)* 146(NC_HSIO3_P)* 148(NC_IO62)* 149(NC_IO61)* 150(NC_IO60)* 157(NC_IO59)* 158(NC_IO58)* 159(NC_IO57)* 166(NC_IO56)* 167(NC_IO55)* 168(NC_IO54)* 175(NC_IO53)* 176(NC_IO52)* 177(NC_IO51)* 181(NC_HSIO4_N)* 182(NC_HSIO4_P)* 184(NC_IO50)* 186(NC_IO49)* 188(NC_VDD_H11)* 193(NC_IO48)* 195(NC_IO47)* 202(NC_IO46)* 203(NC_IO45)* 204(NC_IO44)* 207(NC_VDD_G10)* 208(NC_VDD_G9)* 211(NC_IO43)* 212(NC_IO42)* 213(NC_IO41)* 217(NC_HSIO5_N)* 218(NCHS_IO5_P)* 220(NC_IO40)* 221(NC_IO39)* 222(NC_IO38)* 229(NC_IO37)* 230(NC_IO36)* 231(NC_IO35)* 238(NC_IO34)* 240(NC_IO33)* 247(NC_IO32)* 249(NC_IO31)* 251(NC_HSIO12_N)* 252(NC_HSIO12_P)* 253(NC_HSIO6_N)* 254(NC_HSIO6_P)* 256(NC_IO30)* 257(NC_IO29)* 258(NC_IO28)* 265(NC_IO27)* 266(NC_IO26)* 267(NC_IO25)* 271(NC_IO24)* 272(NC_IO23)* 273(NC_IO22)* 274(NC_IO21)* 284(NC_IO20)* 285(NC_IO19)* 286(NC_IO18)* 287(NC_IO17)* 288(NC_IO16)* 289(NC_IO15)* 291(NC_IO14)* 292(NC_IO13)* 303(NC_IO12)* 304(NC_IO11)* 306(NC_IO10)* 307(NC_IO9)* 308(NC_IO8)* 309(NC_IO7)* 310(NC_IO6)* 320(NC_IO5)* 321(NC_IO4)* 322(NC_IO3)* 323(NC_IO2)* 324(NC_IO1)*

### Notes on the sheet
- 32MHz

### Library data of the parts
*2 = CMP-00028-00007-1
C81 = Cap: Capacitor; Published: 8-Jun-2000; LatestRevisionDate: 17-Jul-2002; LatestRevisionNote: Re-released for DXP Platform.; PackageReference: RAD-0.3; Publisher: Altium Limited; PackageDescription: Radial Cap, Thru-Hole; 2 Leads; 0.3 in Pin Spacing
C82 = CMP-001-00017-6: Chip Capacitor, 100 nF, +/- 10%, 50 V, 0603 (1608 Metric); Voltage Rating: 50V; Capacitor Type: Ceramic; Tolerance: 10%; Mounting Technology: SM; Max Operating Temperature: 125°C; RoHS Compliant: True; Pins: 2; Case/Package: 0603; Min Operating Temperature: -55°C
H1 H2 = CMP-1502-01072-1: THT Vertical Pin Header WR-PHD, Pitch 2.54 mm, Dual Row, 6 pins; Manufacturer: Wurth Elektronik; Contact Resistance: 20mOhm; Withstanding Voltage: 500VAC; Pin Number: 6; Gender: Male; Pitch: 2.54mm; Working Voltage: 250VAC; Rated Current: 3A; Packaging: Bag; Row Number: Dual; Manufacturer URL: http://www.we-online.de; Part Number: 61300621121; Operating Temperature: -40to105degC; Mounting Technology: THT; Package Reference: 61300621121; Datasheet URL: https://katalog.we-online.de/em/datasheet/6130xx21121.pdf; Orientation: Vertical; Publisher: WurthElektronik
J14 = CMP-013-000000-2: Board-To-Board Connector, Vita 57 XMC, ASP Series, Surface Mount, Header, 400, 1.27 mm; Source: ASP-134488-01.SchLib; MP: ASP-134488-01; Package: None; Component Type: Standard; Availability: Unavailable; Design Item ID: ASP-134488-01; Value: *; Price: None; Pin Count: 400
J15-J21 = CMP-42753-000002-1: CONN SMA JACK STR 50 OHM PCB
P29 = Header 30: Header, 30-Pin; LatestRevisionDate: 17-Jul-2002; LatestRevisionNote: Re-released for DXP Platform.; Publisher: Altium Limited
P30 = Header 4: Header, 4-Pin; LatestRevisionDate: 17-Jul-2002; LatestRevisionNote: Re-released for DXP Platform.; Publisher: Altium Limited
P31 P32 = Header 2: Header, 2-Pin; LatestRevisionDate: 17-Jul-2002; LatestRevisionNote: Re-released for DXP Platform.; Publisher: Altium Limited
P33 = CMP-1676-00001-5: Male Header, Pitch 2.54 mm, 1 x 3 Position, Height 8.38 mm, Tail Length 3.18 mm, RoHS, Bulk; Manufacturer: Molex; Rows: 1; Voltage Rating: 250 V; Current Rating: 4 A; Min Operating Temperature: 0 degC; Lead Pitch: 0.1 inch; Packaging: Bulk; Contact Finish: Gold; RoHSCompliant: true; Contact Material: Brass; PackageReference: 22-28-4033; REACH SVHC: Unknown; PackageDescription: Male Header, Pitch 2.54 mm, 1 x 3 Position, Height 8.38 mm, Tail Length 3.18 mm; ComponentLink2URL: http://www.molex.com/pdm_docs/sd/022284033_sd.pdf; Height: 8.38 mm; Mounting Technology: Through Hole; ComponentLink1Description: Manufacturer URL; Length: 7.62 mm; Mount: Through Hole; DatasheetVersion: Rev. G, 01/2012; Max Operating Temperature: 75 degC; ComponentLink2Description: Datasheet; Colour: Black; Pins: 3; Contact Plating: Gold; Package Quantity: 1; ComponentLink1URL: http://www.molex.com/
P34 P35 = CMP-2000-07492-1: Male Header, Pitch 2.54 mm, 1 x 2 Position, Height 8.21 mm, Tail Length 3.05 mm, -65 to 105 degC, RoHS, Bulk; Manufacturer: TE Connectivity; Mating Connector Lock: No(Without); Number of Positions: 2; Pitch: 2.54mm; PCB Mounting Orientation: Vertical; Keyed: No; Case\/Package: 100; Mating Post Length: 0.23inch; High Temperature Housing: Yes; Max Current Rating: 5A; PCB Thickness: 0.063inch; PCB Mount Retention: Without; Approvals: CSA; Current Rating: 3A; Radiation Hardening: No; Length: 4.67mm; Contact Mating Length: 0.23inch; Connector Type: Header; Number of Rows: 1; Termination Post Length: 0.12inch; Board Standoff: No(Without); Max Operating Temperature: 105degC; Contact Shape: Square; Selectively Loaded: No(Without); Gasket: No(Without); Number of Contacts: 2; Contact Gender: Male; Mating Alignment: No(Without); Manufacturer URL: http://www.te.com/; Datasheet URL: http://www.te.com/commerce/DocumentDelivery/DDEController?Action=showdoc&DocId=Customer+Drawing%7F146280%7FH1%7Fpdf%7FEnglish%7FENG_CD_146280_H1.pdf%7F5-146280-2; Mount: ThroughHole; Orientation: Straight; Packaging: Carton; Package Reference: 5-146280-2; Package Quantity: 500; Stabilizers: No(Without); Row Spacing: 2.54mm; Contact Material: CopperAlloy; Panel Mount Retention: No(Without); Datasheet Version: Rev. H1, 08/2016; Housing Colour: Black; Colour: Black; Package Description: Male Header, Pitch 2.54 mm, 1 x 2 Position, Height 8.21 mm, Tail Length 3.05 mm; Contact Plating: Matte; Housing Material: Polymer; Contact Protection: No(Without); Min Operating Temperature: -65degC; Mounting Technology: ThroughHole; Flammability Rating: UL94V-0; RoHSCompliant: true; Termination: ThroughHole; Depth: 2.34mm; High Speed Serial Data Connector: No
R69-R74 = DISCRETE_R: 0 0603
R75 = CMP-009-00017-5: Chip Resistor, 10 KOhm, +/- 1%, 01 W, -55 to 155 degC, 0603 (1608 Metric); Voltage Rating: 50V; Power: 100mW; RoHS Compliant: True; Min Operating Temperature: -55°C; Pins: 2; Case/Package: 0603; Mounting Technology: SM; Max Operating Temperature: 155°C; Tolerance: 1%
R76-R84 = CMP-009-00062-2: Jumper 0402 (1005 Metric); Pins: 2; Mounting Technology: SMT; Case/Package: 0402
U13 = SCuM-V-2: SCuM-V chip from Sp22 Tapeout class
Y1 = CMP-40224-000047-1: XTAL OSC XO 16MHZ CMOS SMD

## Sheet Power.SchDoc
size A2
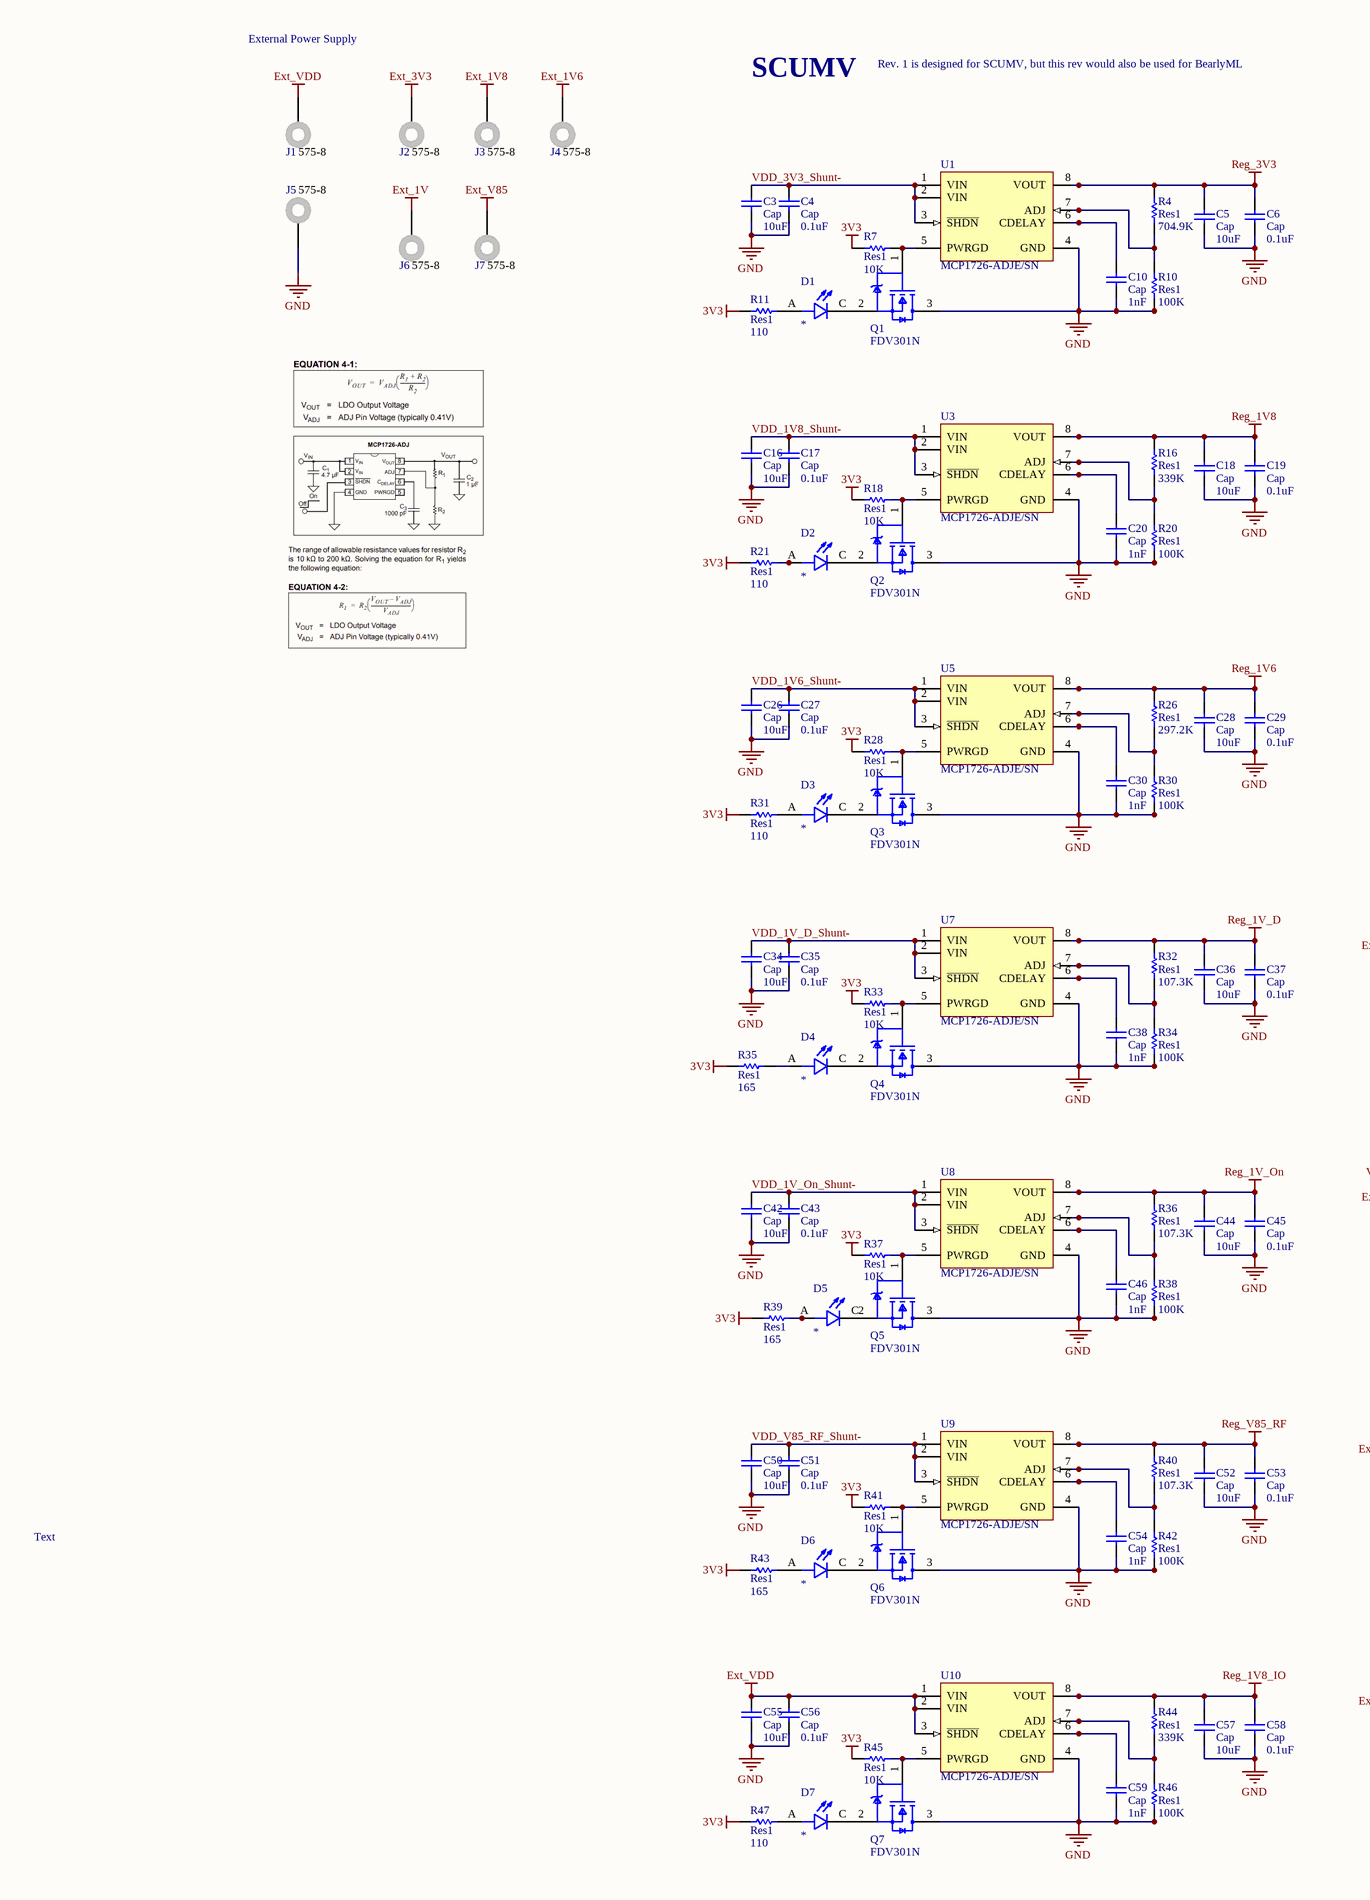
[diagram p5: Power.SchDoc, left]
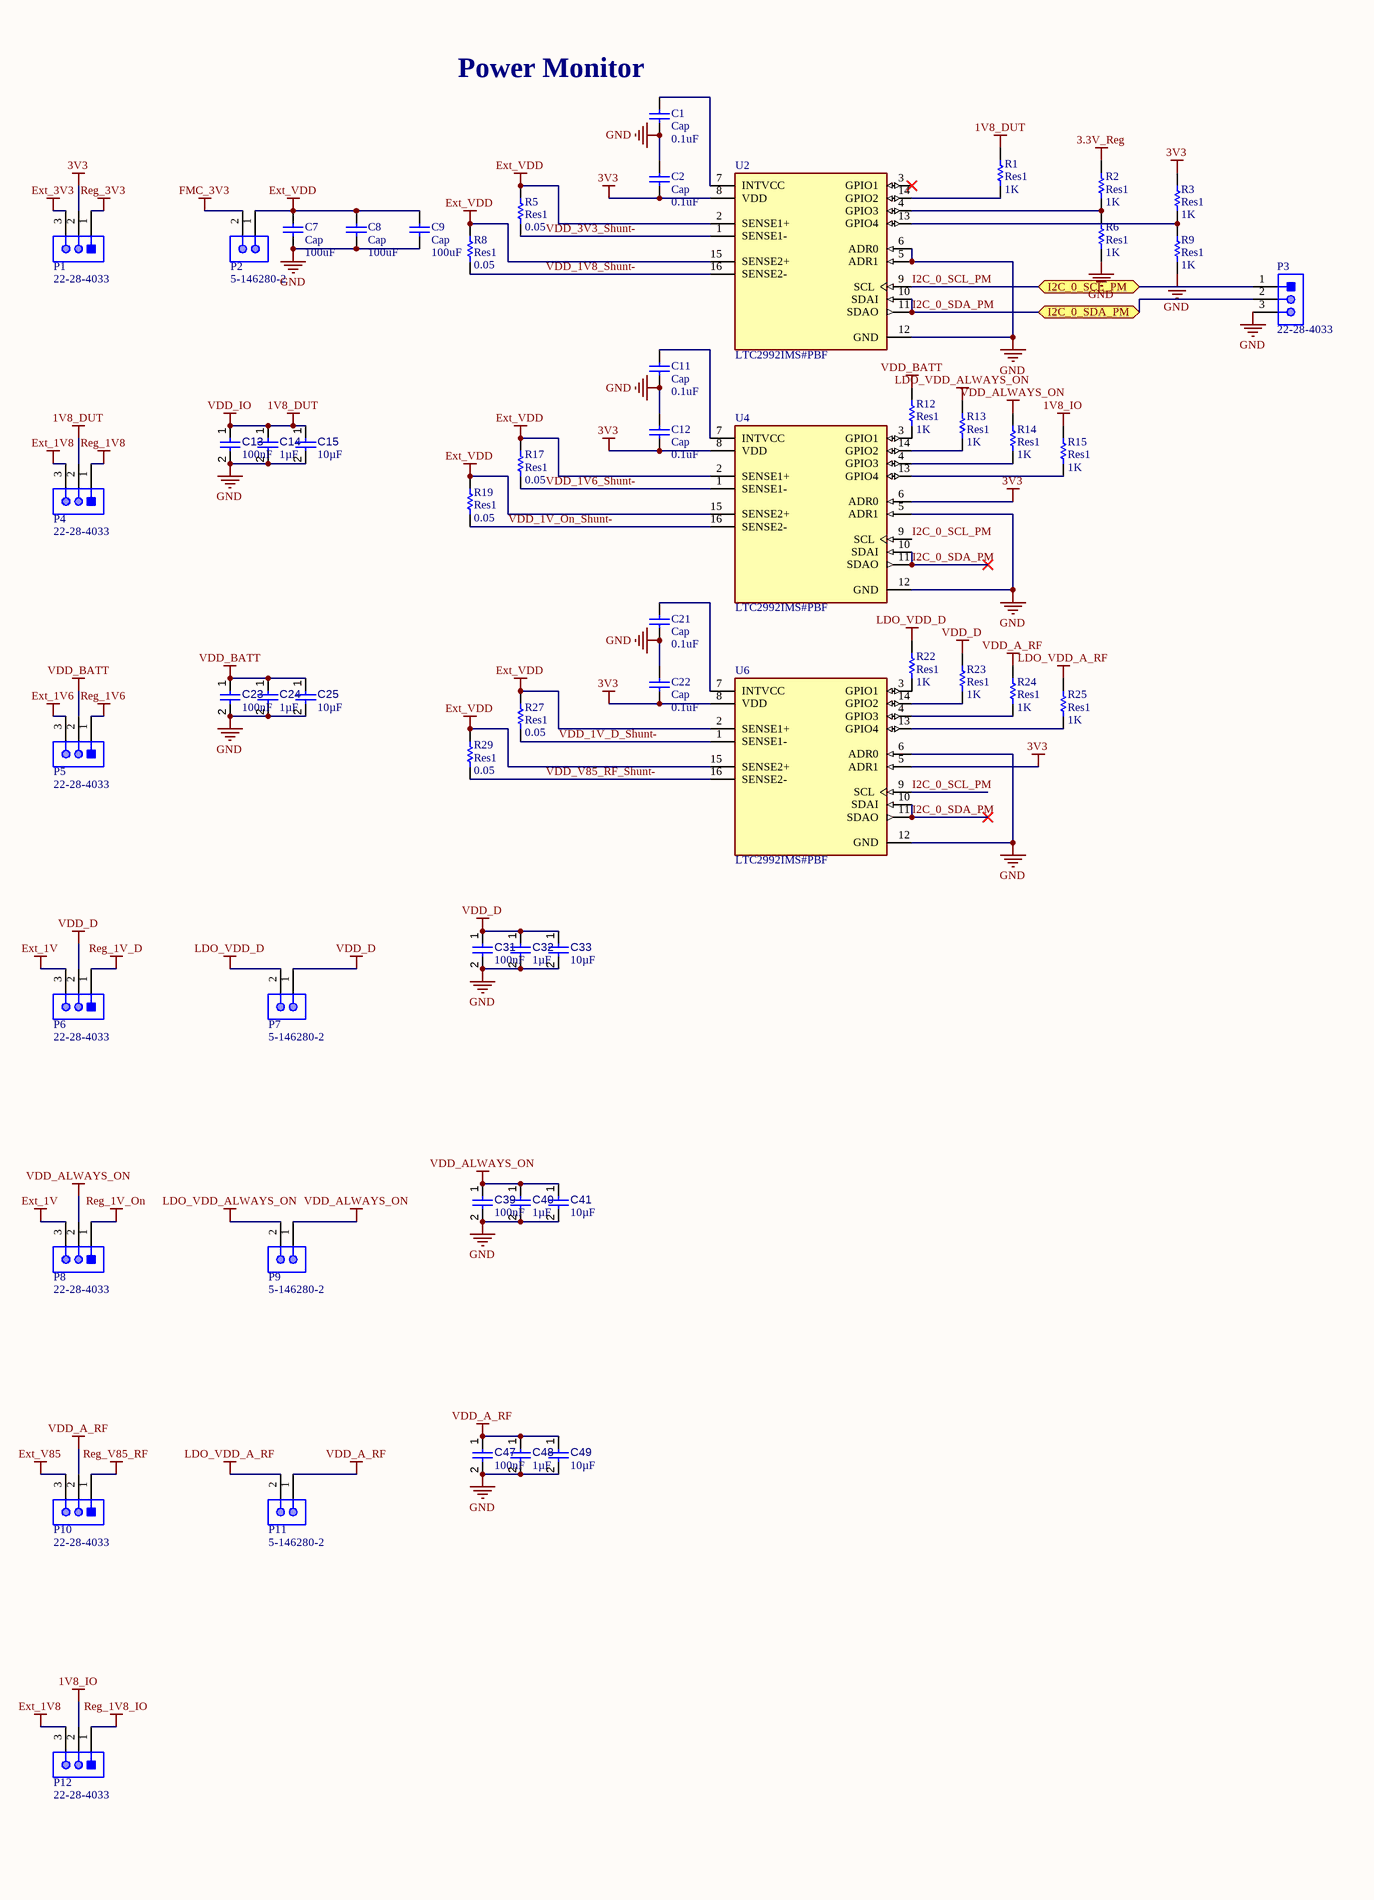
[diagram p6: Power.SchDoc, right]

### Parts
C1  Cap  value 0.1uF  [0603]
C2  Cap  value 0.1uF  [0603]
C3  Cap  value 10uF  [0805]
C4  Cap  value 0.1uF  [0603]
C5  Cap  value 10uF  [0805]
C6  Cap  value 0.1uF  [0603]
C7  Cap  value 100uF  [0805]
C8  Cap  value 100uF  [0805]
C9  Cap  value 100uF  [0805]
C10  Cap  value 1nF  [0603]
C11  Cap  value 0.1uF  [0603]
C12  Cap  value 0.1uF  [0603]
C13  value 100nF  [CAPC0402(1005)60_L]  (hidden comment: Capacitor 100nF +/-20% 10V 0402)
C14  value 1µF  [CAPC0402(1005)60_L]  (hidden comment: Capacitor 1µF +/-20% 10V 0402)
C15  value 10µF  [CAPC0402(1005)60_L]  (hidden comment: Capacitor 10µF +/-40% 6.3V 0402)
C16  Cap  value 10uF  [0805]
C17  Cap  value 0.1uF  [0603]
C18  Cap  value 10uF  [0805]
C19  Cap  value 0.1uF  [0603]
C20  Cap  value 1nF  [0603]
C21  Cap  value 0.1uF  [0603]
C22  Cap  value 0.1uF  [0603]
C23  value 100nF  [CAPC0402(1005)60_L]  (hidden comment: Capacitor 100nF +/-20% 10V 0402)
C24  value 1µF  [CAPC0402(1005)60_L]  (hidden comment: Capacitor 1µF +/-20% 10V 0402)
C25  value 10µF  [CAPC0402(1005)60_L]  (hidden comment: Capacitor 10µF +/-40% 6.3V 0402)
C26  Cap  value 10uF  [0805]
C27  Cap  value 0.1uF  [0603]
C28  Cap  value 10uF  [0805]
C29  Cap  value 0.1uF  [0603]
C30  Cap  value 1nF  [0603]
C31  value 100nF  [CAPC0402(1005)60_L]  (hidden comment: Capacitor 100nF +/-20% 10V 0402)
C32  value 1µF  [CAPC0402(1005)60_L]  (hidden comment: Capacitor 1µF +/-20% 10V 0402)
C33  value 10µF  [CAPC0402(1005)60_L]  (hidden comment: Capacitor 10µF +/-40% 6.3V 0402)
C34  Cap  value 10uF  [0805]
C35  Cap  value 0.1uF  [0603]
C36  Cap  value 10uF  [0805]
C37  Cap  value 0.1uF  [0603]
C38  Cap  value 1nF  [0603]
C39  value 100nF  [CAPC0402(1005)60_L]  (hidden comment: Capacitor 100nF +/-20% 10V 0402)
C40  value 1µF  [CAPC0402(1005)60_L]  (hidden comment: Capacitor 1µF +/-20% 10V 0402)
C41  value 10µF  [CAPC0402(1005)60_L]  (hidden comment: Capacitor 10µF +/-40% 6.3V 0402)
C42  Cap  value 10uF  [0805]
C43  Cap  value 0.1uF  [0603]
C44  Cap  value 10uF  [0805]
C45  Cap  value 0.1uF  [0603]
C46  Cap  value 1nF  [0603]
C47  value 100nF  [CAPC0402(1005)60_L]  (hidden comment: Capacitor 100nF +/-20% 10V 0402)
C48  value 1µF  [CAPC0402(1005)60_L]  (hidden comment: Capacitor 1µF +/-20% 10V 0402)
C49  value 10µF  [CAPC0402(1005)60_L]  (hidden comment: Capacitor 10µF +/-40% 6.3V 0402)
C50  Cap  value 10uF  [0805]
C51  Cap  value 0.1uF  [0603]
C52  Cap  value 10uF  [0805]
C53  Cap  value 0.1uF  [0603]
C54  Cap  value 1nF  [0603]
C55  Cap  value 10uF  [0805]
C56  Cap  value 0.1uF  [0603]
C57  Cap  value 10uF  [0805]
C58  Cap  value 0.1uF  [0603]
C59  Cap  value 1nF  [0603]
D1  LTW-C191DS5  [LED0603]  (value not drawn)
D2  LTW-C191DS5  [LED0603]  (value not drawn)
D3  LTW-C191DS5  [LED0603]  (value not drawn)
D4  LTW-C191DS5  [LED0603]  (value not drawn)
D5  LTW-C191DS5  [LED0603]  (value not drawn)
D6  LTW-C191DS5  [LED0603]  (value not drawn)
D7  LTW-C191DS5  [LED0603]  (value not drawn)
J1  575-8  [KSTN-575-8]
J2  575-8  [KSTN-575-8]
J3  575-8  [KSTN-575-8]
J4  575-8  [KSTN-575-8]
J5  575-8  [KSTN-575-8]
J6  575-8  [KSTN-575-8]
J7  575-8  [KSTN-575-8]
P1  22-28-4033  [MOLX-22-28-4033_V]
P2  5-146280-2  [TECO-5-146280-2_V]
P3  22-28-4033  [MOLX-22-28-4033_V]
P4  22-28-4033  [MOLX-22-28-4033_V]
P5  22-28-4033  [MOLX-22-28-4033_V]
P6  22-28-4033  [MOLX-22-28-4033_V]
P7  5-146280-2  [TECO-5-146280-2_V]
P8  22-28-4033  [MOLX-22-28-4033_V]
P9  5-146280-2  [TECO-5-146280-2_V]
P10  22-28-4033  [MOLX-22-28-4033_V]
P11  5-146280-2  [TECO-5-146280-2_V]
P12  22-28-4033  [MOLX-22-28-4033_V]
Q1  FDV301N  [FP-318-08-MFG]
Q2  FDV301N  [FP-318-08-MFG]
Q3  FDV301N  [FP-318-08-MFG]
Q4  FDV301N  [FP-318-08-MFG]
Q5  FDV301N  [FP-318-08-MFG]
Q6  FDV301N  [FP-318-08-MFG]
Q7  FDV301N  [FP-318-08-MFG]
R1  Res1  value 1K  [0603]
R2  Res1  value 1K  [0603]
R3  Res1  value 1K  [0603]
R4  Res1  value 704.9K  [0603]
R5  Res1  value 0.05  [0603]
R6  Res1  value 1K  [0603]
R7  Res1  value 10K  [0603]
R8  Res1  value 0.05  [0603]
R9  Res1  value 1K  [0603]
R10  Res1  value 100K  [0603]
R11  Res1  value 110  [0603]
R12  Res1  value 1K  [0603]
R13  Res1  value 1K  [0603]
R14  Res1  value 1K  [0603]
R15  Res1  value 1K  [0603]
R16  Res1  value 339K  [0603]
R17  Res1  value 0.05  [0603]
R18  Res1  value 10K  [0603]
R19  Res1  value 0.05  [0603]
R20  Res1  value 100K  [0603]
R21  Res1  value 110  [0603]
R22  Res1  value 1K  [0603]
R23  Res1  value 1K  [0603]
R24  Res1  value 1K  [0603]
R25  Res1  value 1K  [0603]
R26  Res1  value 297.2K  [0603]
R27  Res1  value 0.05  [0603]
R28  Res1  value 10K  [0603]
R29  Res1  value 0.05  [0603]
R30  Res1  value 100K  [0603]
R31  Res1  value 110  [0603]
R32  Res1  value 107.3K  [0603]
R33  Res1  value 10K  [0603]
R34  Res1  value 100K  [0603]
R35  Res1  value 165  [0603]
R36  Res1  value 107.3K  [0603]
R37  Res1  value 10K  [0603]
R38  Res1  value 100K  [0603]
R39  Res1  value 165  [0603]
R40  Res1  value 107.3K  [0603]
R41  Res1  value 10K  [0603]
R42  Res1  value 100K  [0603]
R43  Res1  value 165  [0603]
R44  Res1  value 339K  [0603]
R45  Res1  value 10K  [0603]
R46  Res1  value 100K  [0603]
R47  Res1  value 110  [0603]
U1  MCP1726-ADJE/SN  [SOIC-SN8_N]
U2  LTC2992IMS#PBF  [FP-MS-16-05-08-1669-IPC_C]
U3  MCP1726-ADJE/SN  [SOIC-SN8_N]
U4  LTC2992IMS#PBF  [FP-MS-16-05-08-1669-IPC_C]
U5  MCP1726-ADJE/SN  [SOIC-SN8_N]
U6  LTC2992IMS#PBF  [FP-MS-16-05-08-1669-IPC_C]
U7  MCP1726-ADJE/SN  [SOIC-SN8_N]
U8  MCP1726-ADJE/SN  [SOIC-SN8_N]
U9  MCP1726-ADJE/SN  [SOIC-SN8_N]
U10  MCP1726-ADJE/SN  [SOIC-SN8_N]

### Ports
I2C_0_SCL_PM (bidir), I2C_0_SDA_PM (bidir)

### Nets
1V8_DUT: C13.1 C14.1 C15.1 P4.2 R1.1  [also labelled VDD_IO]
1V8_IO: P12.2 R15.1
3.3V_Reg: R2.1
3V3: C2.2 C12.2 C22.2 P1.2 R3.1 R7.1 R11.1 R18.1 R21.1 R28.1 R31.1 R33.1 R35.1 R37.1 R39.1 R41.1 R43.1 R45.1 R47.1 U2.8(VDD) U4.6(ADR0) U4.8(VDD) U6.5(ADR1) U6.8(VDD)
Ext_1V: J6.1 P6.3 P8.3
Ext_1V6: J4.1 P5.3
Ext_1V8: J3.1 P4.3 P12.3
Ext_3V3: J2.1 P1.3
Ext_V85: J7.1 P10.3
Ext_VDD: C7.2 C8.2 C9.2 C55.2 C56.2 J1.1 P2.1 R5.2 R8.2 R17.2 R19.2 R27.2 R29.2 U2.2(SENSE1+) U2.15(SENSE2+) U4.2(SENSE1+) U4.15(SENSE2+) U6.2(SENSE1+) U6.15(SENSE2+) U10.1(VIN) U10.2(VIN) U10.3(~{SHDN})
FMC_3V3: P2.2
GND: C1.2 C2.1 C3.1 C4.1 C5.1 C6.1 C7.1 C8.1 C9.1 C10.1 C11.2 C12.1 C13.2 C14.2 C15.2 C16.1 C17.1 C18.1 C19.1 C20.1 C21.2 C22.1 C23.2 C24.2 C25.2 C26.1 C27.1 C28.1 C29.1 C30.1 C31.2 C32.2 C33.2 C34.1 C35.1 C36.1 C37.1 C38.1 C39.2 C40.2 C41.2 C42.1 C43.1 C44.1 C45.1 C46.1 C47.2 C48.2 C49.2 C50.1 C51.1 C52.1 C53.1 C54.1 C55.1 C56.1 C57.1 C58.1 C59.1 J5.1 P3.3 Q1.3(D) Q2.3(D) Q3.3(D) Q4.3(D) Q5.3(D) Q6.3(D) Q7.3(D) R6.2 R9.2 R10.1 R20.1 R30.1 R34.1 R38.1 R42.1 R46.1 U1.4(GND) U2.5(ADR1) U2.6(ADR0) U2.12(GND) U3.4(GND) U4.5(ADR1) U4.12(GND) U5.4(GND) U6.6(ADR0) U6.12(GND) U7.4(GND) U8.4(GND) U9.4(GND) U10.4(GND)
LDO_VDD_A_RF: P11.2 R25.1
LDO_VDD_ALWAYS_ON: P9.2 R13.1
LDO_VDD_D: P7.2 R22.1
Reg_1V6: C28.2 C29.2 P5.1 R26.2 U5.8(VOUT)
Reg_1V8: C18.2 C19.2 P4.1 R16.2 U3.8(VOUT)
Reg_1V8_IO: C57.2 C58.2 P12.1 R44.2 U10.8(VOUT)
Reg_1V_D: C36.2 C37.2 P6.1 R32.2 U7.8(VOUT)
Reg_1V_On: C44.2 C45.2 P8.1 R36.2 U8.8(VOUT)
Reg_3V3: C5.2 C6.2 P1.1 R4.2 U1.8(VOUT)
Reg_V85_RF: C52.2 C53.2 P10.1 R40.2 U9.8(VOUT)
VDD_A_RF: C47.1 C48.1 C49.1 P10.2 P11.1 R24.1
VDD_ALWAYS_ON: C39.1 C40.1 C41.1 P8.2 P9.1 R14.1
VDD_BATT: C23.1 C24.1 C25.1 P5.2 R12.1
VDD_D: C31.1 C32.1 C33.1 P6.2 P7.1 R23.1
I2C_0_SCL_PM: P3.1 U2.9(SCL) U4.9(SCL) U6.9(SCL) ; port I2C_0_SCL_PM  [project net I2C2_SCL]
I2C_0_SDA_PM: P3.2 U2.10(SDAI) U2.11(SDAO) U4.10(SDAI) U4.11(SDAO) U6.10(SDAI) U6.11(SDAO) ; port I2C_0_SDA_PM  [project net I2C2_SDA]
VDD_1V6_Shunt-: C26.2 C27.2 R17.1 U4.1(SENSE1-) U5.1(VIN) U5.2(VIN) U5.3(~{SHDN})
VDD_1V8_Shunt-: C16.2 C17.2 R8.1 U2.16(SENSE2-) U3.1(VIN) U3.2(VIN) U3.3(~{SHDN})
VDD_1V_D_Shunt-: C34.2 C35.2 R27.1 U6.1(SENSE1-) U7.1(VIN) U7.2(VIN) U7.3(~{SHDN})
VDD_1V_On_Shunt-: C42.2 C43.2 R19.1 U4.16(SENSE2-) U8.1(VIN) U8.2(VIN) U8.3(~{SHDN})
VDD_3V3_Shunt-: C3.2 C4.2 R5.1 U1.1(VIN) U1.2(VIN) U1.3(~{SHDN}) U2.1(SENSE1-)
VDD_V85_RF_Shunt-: C50.2 C51.2 R29.1 U6.16(SENSE2-) U9.1(VIN) U9.2(VIN) U9.3(~{SHDN})
NetC1_1: C1.1 U2.7(INTVCC)
NetC10_2: C10.2 U1.6(CDELAY)
NetC11_1: C11.1 U4.7(INTVCC)
NetC20_2: C20.2 U3.6(CDELAY)
NetC21_1: C21.1 U6.7(INTVCC)
NetC30_2: C30.2 U5.6(CDELAY)
NetC38_2: C38.2 U7.6(CDELAY)
NetC46_2: C46.2 U8.6(CDELAY)
NetC54_2: C54.2 U9.6(CDELAY)
NetC59_2: C59.2 U10.6(CDELAY)
NetD1_A: D1.A R11.2
NetD1_C: D1.C Q1.2(S)
NetD2_A: D2.A R21.2
NetD2_C: D2.C Q2.2(S)
NetD3_A: D3.A R31.2
NetD3_C: D3.C Q3.2(S)
NetD4_A: D4.A R35.2
NetD4_C: D4.C Q4.2(S)
NetD5_A: D5.A R39.2
NetD6_A: D6.A R43.2
NetD6_C: D6.C Q6.2(S)
NetD7_A: D7.A R47.2
NetD7_C: D7.C Q7.2(S)
NetQ1_1: Q1.1(G) R7.2 U1.5(PWRGD)
NetQ2_1: Q2.1(G) R18.2 U3.5(PWRGD)
NetQ3_1: Q3.1(G) R28.2 U5.5(PWRGD)
NetQ4_1: Q4.1(G) R33.2 U7.5(PWRGD)
NetQ5_1: Q5.1(G) R37.2 U8.5(PWRGD)
NetQ6_1: Q6.1(G) R41.2 U9.5(PWRGD)
NetQ7_1: Q7.1(G) R45.2 U10.5(PWRGD)
NetR1_2: R1.2 U2.14(GPIO2)
NetR2_2: R2.2 R6.1 U2.4(GPIO3)
NetR3_2: R3.2 R9.1 U2.13(GPIO4)
NetR4_1: R4.1 R10.2 U1.7(ADJ)
NetR12_2: R12.2 U4.3(GPIO1)
NetR13_2: R13.2 U4.14(GPIO2)
NetR14_2: R14.2 U4.4(GPIO3)
NetR15_2: R15.2 U4.13(GPIO4)
NetR16_1: R16.1 R20.2 U3.7(ADJ)
NetR22_2: R22.2 U6.3(GPIO1)
NetR23_2: R23.2 U6.14(GPIO2)
NetR24_2: R24.2 U6.4(GPIO3)
NetR25_2: R25.2 U6.13(GPIO4)
NetR26_1: R26.1 R30.2 U5.7(ADJ)
NetR32_1: R32.1 R34.2 U7.7(ADJ)
NetR36_1: R36.1 R38.2 U8.7(ADJ)
NetR40_1: R40.1 R42.2 U9.7(ADJ)
NetR44_1: R44.1 R46.2 U10.7(ADJ)

Not connected (* = marked no-connect by the designer): D5 C; Q5 2(S); U2 3(GPIO1)*

### Notes on the sheet
- External Power Supply
- Rev. 1 is designed for SCUMV, but this rev would also be used for BearlyML
- SCUMV
- (near C1) Power Monitor
- Text

### Library data of the parts
C1-C12 C16-C22 C26-C30 C34-C38 C42-C46 C50-C59 = Cap: Capacitor; Published: 8-Jun-2000; LatestRevisionDate: 17-Jul-2002; LatestRevisionNote: Re-released for DXP Platform.; PackageReference: RAD-0.3; Publisher: Altium Limited; PackageDescription: Radial Cap, Thru-Hole; 2 Leads; 0.3 in Pin Spacing
C13 C23 C31 C39 C47 = CMP-001-00061-3: Chip Capacitor, 100nF +/-20%, 10V, 0402, Thickness 0.6 mm; Tolerance: 20%; Mounting Technology: SMT; Voltage Rating: 10V; Max Operating Temperature: 85°C; Pins: 2; Case/Package: 0402; Min Operating Temperature: -55°C
C14 C24 C32 C40 C48 = CMP-001-00063-3: Chip Capacitor, 1µF +/-20%, 10V, 0402, Thickness 0.6 mm; Tolerance: 10%; Mounting Technology: SMT; Max Operating Temperature: 85°C; Voltage Rating: 10V; Pins: 2; Case/Package: 0402; Min Operating Temperature: -55°C
C15 C25 C33 C41 C49 = CMP-001-00074-3: Chip Capacitor, 10µF +/-40%, 6.3V, 0402, Thickness 0.6 mm; Tolerance: 10%; Case/Package: 0402; Pins: 2; Mounting Technology: SMT; Voltage Rating: 6.3V; Max Operating Temperature: 85°C; Min Operating Temperature: -55°C
D1-D7 = CMP-022-000000-2: White LED Indication - Discrete 2.93V 0603 _1608 Metric_; MF: Lite-On Inc.; Price: None; MP: LTW-C191DS5; Design Item ID: LTW-C191DS5; Availability: Unavailable; SnapEDA_Link: https://www.snapeda.com/parts/LTW-C191DS5/Lite-On%20Inc./view-part/199753/?ref=snap; Value: *; Source: SnapEDAsch.SchLib; Pin Count: 2; Component Type: Standard; Package: 0603 Lite-On
J1-J7 = CMP-1672-00007-5: Non-Insulated Jack, Through Hole, RoHS, Bulk; Manufacturer: Keystone; PackageDescription: 1-Pin Through Hole Device, Dia 7.92 mm; PackageReference: 575-8; ComponentLink1Description: Manufacturer URL; Mounting Technology: Through Hole; ComponentLink2URL: http://www.keyelco.com/product-pdf.cfm?p=2379; ComponentLink2Description: Datasheet; DatasheetVersion: Rev. B, 11/1994; ComponentLink1URL: http://www.keyelco.com/
P1 P3-P6 P8 P10 P12 = CMP-1676-00001-5: as P33 on sheet DUT; Min Operating Temperature: 0 degC; Lead Pitch: 0.1 inch; Packaging: Bulk; Contact Finish: Gold; RoHSCompliant: true; Contact Material: Brass; PackageReference: 22-28-4033; REACH SVHC: Unknown; PackageDescription: Male Header, Pitch 2.54 mm, 1 x 3 Position, Height 8.38 mm, Tail Length 3.18 mm; ComponentLink2URL: http://www.molex.com/pdm_docs/sd/022284033_sd.pdf; Height: 8.38 mm; Mounting Technology: Through Hole; ComponentLink1Description: Manufacturer URL; Length: 7.62 mm; Mount: Through Hole; DatasheetVersion: Rev. G, 01/2012; Max Operating Temperature: 75 degC; ComponentLink2Description: Datasheet; Colour: Black; Pins: 3; Contact Plating: Gold; Package Quantity: 1; ComponentLink1URL: http://www.molex.com/
P2 P7 P9 P11 = CMP-2000-07492-1: as P34 on sheet DUT; Radiation Hardening: No; Length: 4.67mm; Contact Mating Length: 0.23inch; Connector Type: Header; Number of Rows: 1; Termination Post Length: 0.12inch; Board Standoff: No(Without); Max Operating Temperature: 105degC; Contact Shape: Square; Selectively Loaded: No(Without); Gasket: No(Without); Number of Contacts: 2; Contact Gender: Male; Mating Alignment: No(Without); Manufacturer URL: http://www.te.com/; Datasheet URL: http://www.te.com/commerce/DocumentDelivery/DDEController?Action=showdoc&DocId=Customer+Drawing%7F146280%7FH1%7Fpdf%7FEnglish%7FENG_CD_146280_H1.pdf%7F5-146280-2; Mount: ThroughHole; Orientation: Straight; Packaging: Carton; Package Reference: 5-146280-2; Package Quantity: 500; Stabilizers: No(Without); Row Spacing: 2.54mm; Contact Material: CopperAlloy; Panel Mount Retention: No(Without); Datasheet Version: Rev. H1, 08/2016; Housing Colour: Black; Colour: Black; Package Description: Male Header, Pitch 2.54 mm, 1 x 2 Position, Height 8.21 mm, Tail Length 3.05 mm; Contact Plating: Matte; Housing Material: Polymer; Contact Protection: No(Without); Min Operating Temperature: -65degC; Mounting Technology: ThroughHole; Flammability Rating: UL94V-0; RoHSCompliant: true; Termination: ThroughHole; Depth: 2.34mm; High Speed Serial Data Connector: No
Q1-Q7 = CMP-2000-04935-2: MOSFET N-CH 25V 220MA SOT-23; Manufacturer: ON Semiconductor; Turn Off Delay Time: 3.5ns; Typ Forward Diode Voltage: 0.8V; Max Junction Temp: +150°C; Threshold Vgs Max: 1.06V; Threshold Vgs Min: 0.7V; Standoff Height: 0.01mm; Max Forward Diode Voltage: 1.2V; Number Of Channels: 1; Rthja Max: 357°C/W; Drain To Source Resistance: 3.1Ω; Input Capacitace At Vds: 9.5pF @ 10V; Gate Charge At Vgs: 0.49nC @ 4.5V; Transconductance: 0.2S; Turn On Delay Time: 3.2ns; Depletion Mode: False; Power Dissipation: 0.35W; Continuous Drain Current: 0.22A; Gate To Source Voltage: 8V; RoHS: TRUE; Lead Free: Yes; Temperature Range High: +150°C; Automotive: No; Height: 1.11mm; Category: Trans; Mouser Description: MOSFET N-Ch Digital; Drain To Source Voltage: 25V; Temperature: -55°C to +150°C; Ipc Land Pattern Name: SOT95P240X100-3; Device Class L1: Discrete Semiconductors; Octopart: https://octopart.com/fdv301n-on+semiconductor-84326713; Footprint Url: https://www.onsemi.com/pub/Collateral/318-08.PDF; Digikey Description: MOSFET N-CH 25V 220MA SOT-23; Drain To Source Breakdown Voltage: 25V; Temperature Range Low: -55°C; Number Of N Channels: 1; Device Class L3: MOSFETs; Package: 318-08; ComponentLink2URL: https://www.onsemi.com/pub/Collateral/FDV301N-D.PDF; Manufacturer Part Number: FDV301N; Device Class L2: Transistors; ComponentLink2Description: Datasheet
R1-R47 = Res1: Resistor; Published: 8-Jun-2000; LatestRevisionDate: 17-Jul-2002; LatestRevisionNote: Re-released for DXP Platform.; PackageReference: AXIAL-0.3; Publisher: Altium Limited; PackageDescription: Axial Device, Thru-Hole; 2 Leads; 0.3 in Pin Spacing
U1 U3 U5 U7-U10 = CMP-0136-00180-1: 1A, Low Voltage, Low Quiescent Current LDO Regulator, 8-Pin SOIC 150mil, Extended Temperature; Code_IPC: SOIC127P600-8; DatasheetVersion: revC, Aug-2007; PackageVersion: revBB, Aug-2009; Code_JEDEC: MS-012; PackageDescription: 8-Lead Plastic Small Outline (SN) - Narrow, 3.90mm Body [SOIC]; PackageReference: SOIC-SN8
U2 U4 U6 = CMP-09131-000077-1: IC PWR MONITOR DUAL WIDE 16MSOP; RoHS Compliant: Yes